# EAGLE design app1 (EAGLE 6.1)

## Sheet 1 of 8
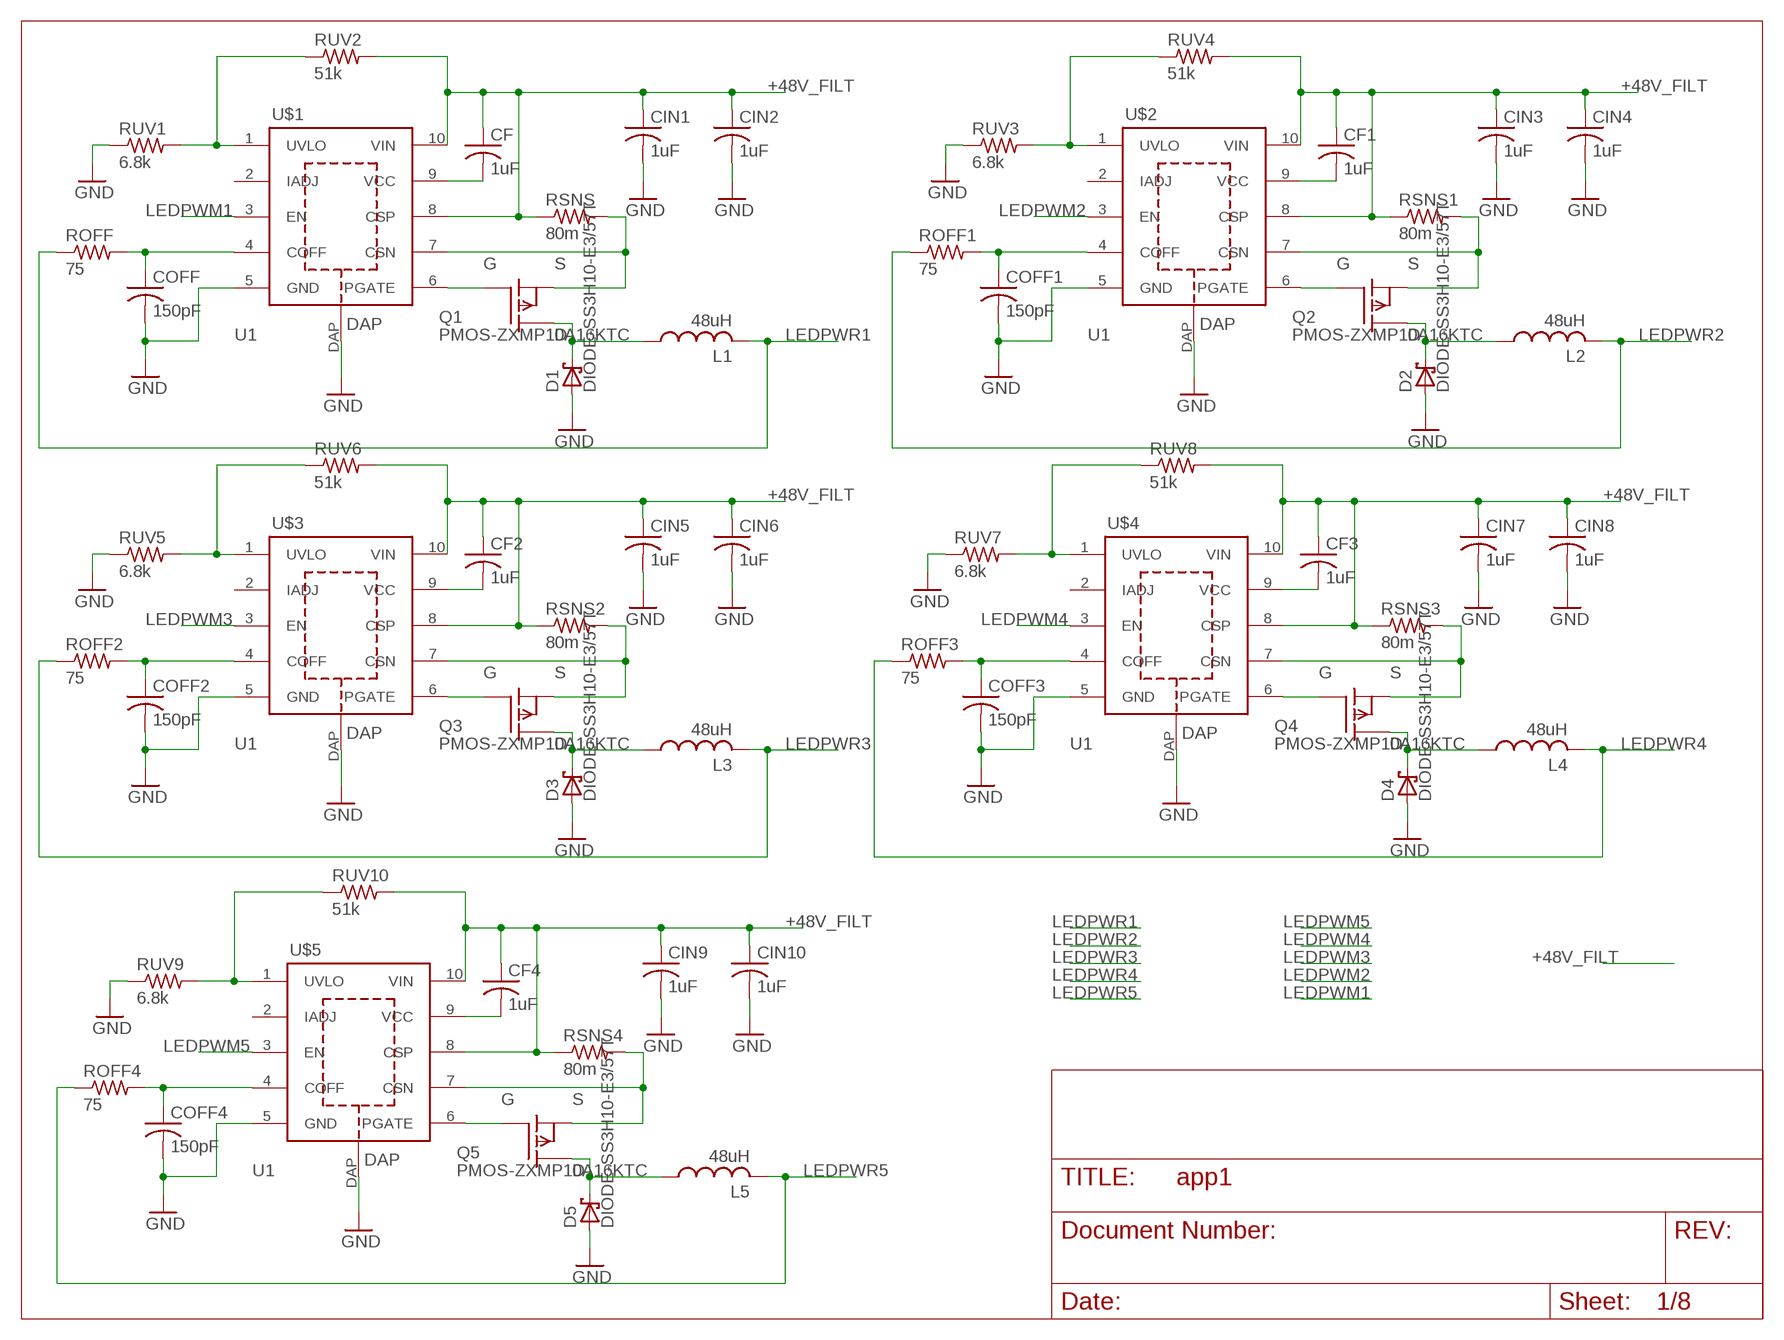
[diagram p0: schematic, sheet 1]

### Parts
CF  1uF  C-USC0603  [C0603]
CF1  1uF  C-USC0603  [C0603]
CF2  1uF  C-USC0603  [C0603]
CF3  1uF  C-USC0603  [C0603]
CF4  1uF  C-USC0603  [C0603]
CIN1  1uF  C-USC1206  [C1206]
CIN2  1uF  C-USC1206  [C1206]
CIN3  1uF  C-USC1206  [C1206]
CIN4  1uF  C-USC1206  [C1206]
CIN5  1uF  C-USC1206  [C1206]
CIN6  1uF  C-USC1206  [C1206]
CIN7  1uF  C-USC1206  [C1206]
CIN8  1uF  C-USC1206  [C1206]
CIN9  1uF  C-USC1206  [C1206]
CIN10  1uF  C-USC1206  [C1206]
COFF  150pF  C-USC0603  [C0603]
COFF1  150pF  C-USC0603  [C0603]
COFF2  150pF  C-USC0603  [C0603]
COFF3  150pF  C-USC0603  [C0603]
COFF4  150pF  C-USC0603  [C0603]
D1  DIODE-SS3H10-E3/57T  DIODE-SS3H10-E3/9AT  [SMC]
D2  DIODE-SS3H10-E3/57T  DIODE-SS3H10-E3/9AT  [SMC]
D3  DIODE-SS3H10-E3/57T  DIODE-SS3H10-E3/9AT  [SMC]
D4  DIODE-SS3H10-E3/57T  DIODE-SS3H10-E3/9AT  [SMC]
D5  DIODE-SS3H10-E3/57T  DIODE-SS3H10-E3/9AT  [SMC]
L1  48uH  SRP1265A  [SRP1265A]
L2  48uH  SRP1265A  [SRP1265A]
L3  48uH  SRP1265A  [SRP1265A]
L4  48uH  SRP1265A  [SRP1265A]
L5  48uH  SRP1265A  [SRP1265A]
Q1  PMOS-ZXMP10A16KTC  PMOS-ZXMP10A18KTC  [TO252]
Q2  PMOS-ZXMP10A16KTC  PMOS-ZXMP10A18KTC  [TO252]
Q3  PMOS-ZXMP10A16KTC  PMOS-ZXMP10A18KTC  [TO252]
Q4  PMOS-ZXMP10A16KTC  PMOS-ZXMP10A18KTC  [TO252]
Q5  PMOS-ZXMP10A16KTC  PMOS-ZXMP10A18KTC  [TO252]
ROFF  75  R-US_R0603  [R0603]
ROFF1  75  R-US_R0603  [R0603]
ROFF2  75  R-US_R0603  [R0603]
ROFF3  75  R-US_R0603  [R0603]
ROFF4  75  R-US_R0603  [R0603]
RSNS  80m  R-US_R2512  [R2512]
RSNS1  80m  R-US_R2512  [R2512]
RSNS2  80m  R-US_R2512  [R2512]
RSNS3  80m  R-US_R2512  [R2512]
RSNS4  80m  R-US_R2512  [R2512]
RUV1  6.8k  R-US_R0603  [R0603]
RUV2  51k  R-US_R0603  [R0603]
RUV3  6.8k  R-US_R0603  [R0603]
RUV4  51k  R-US_R0603  [R0603]
RUV5  6.8k  R-US_R0603  [R0603]
RUV6  51k  R-US_R0603  [R0603]
RUV7  6.8k  R-US_R0603  [R0603]
RUV8  51k  R-US_R0603  [R0603]
RUV9  6.8k  R-US_R0603  [R0603]
RUV10  51k  R-US_R0603  [R0603]
U$1  U1  LM3409HV'LM3409HV'  [VSSOP-10]
U$2  U1  LM3409HV'LM3409HV'  [VSSOP-10]
U$3  U1  LM3409HV'LM3409HV'  [VSSOP-10]
U$4  U1  LM3409HV'LM3409HV'  [VSSOP-10]
U$5  U1  LM3409HV'LM3409HV'  [VSSOP-10]

### Nets
+48V_FILT: CF1.1 CF2.1 CF3.1 CF4.1 CF.1 CIN1.1 CIN2.1 CIN3.1 CIN4.1 CIN5.1 CIN6.1 CIN7.1 CIN8.1 CIN9.1 CIN10.1 RSNS1.1 RSNS2.1 RSNS3.1 RSNS4.1 RSNS.1 RUV2.2 RUV4.2 RUV6.2 RUV8.2 RUV10.2 U$1.8(CSP) U$1.10(VIN) U$2.8(CSP) U$2.10(VIN) U$3.8(CSP) U$3.10(VIN) U$4.8(CSP) U$4.10(VIN) U$5.8(CSP) U$5.10(VIN) ; also sheet 2
GND: CIN1.2 CIN2.2 CIN3.2 CIN4.2 CIN5.2 CIN6.2 CIN7.2 CIN8.2 CIN9.2 CIN10.2 COFF1.2 COFF2.2 COFF3.2 COFF4.2 COFF.2 D1.A D2.A D3.A D4.A D5.A RUV1.1 RUV3.1 RUV5.1 RUV7.1 RUV9.1 U$1.5(GND) U$1.DAP U$2.5(GND) U$2.DAP U$3.5(GND) U$3.DAP U$4.5(GND) U$4.DAP U$5.5(GND) U$5.DAP ; also sheet 2,3,4,5,6,7,8
LEDPWM1: U$1.3(EN) ; also sheet 2
LEDPWM2: U$2.3(EN) ; also sheet 2
LEDPWM3: U$3.3(EN) ; also sheet 2
LEDPWM4: U$4.3(EN) ; also sheet 2
LEDPWM5: U$5.3(EN) ; also sheet 2
LEDPWR1: L1.P$2 ROFF.1 ; also sheet 2
LEDPWR2: L2.P$2 ROFF1.1 ; also sheet 2
LEDPWR3: L3.P$2 ROFF2.1 ; also sheet 2
LEDPWR4: L4.P$2 ROFF3.1 ; also sheet 2
LEDPWR5: L5.P$2 ROFF4.1 ; also sheet 2
N$1: RUV3.2 RUV4.1 U$2.1(UVLO)
N$2: RUV1.2 RUV2.1 U$1.1(UVLO)
N$3: CF.2 U$1.9(VCC)
N$4: Q1.2(S) RSNS.2 U$1.7(CSN)
N$5: COFF.1 ROFF.2 U$1.4(COFF)
N$6: Q1.1(G) U$1.6(PGATE)
N$7: D1.C L1.P$1 Q1.3(D)
N$8: CF1.2 U$2.9(VCC)
N$9: Q2.2(S) RSNS1.2 U$2.7(CSN)
N$10: COFF1.1 ROFF1.2 U$2.4(COFF)
N$11: Q2.1(G) U$2.6(PGATE)
N$12: D2.C L2.P$1 Q2.3(D)
N$13: RUV5.2 RUV6.1 U$3.1(UVLO)
N$14: CF2.2 U$3.9(VCC)
N$15: Q3.2(S) RSNS2.2 U$3.7(CSN)
N$16: COFF2.1 ROFF2.2 U$3.4(COFF)
N$17: Q3.1(G) U$3.6(PGATE)
N$18: D3.C L3.P$1 Q3.3(D)
N$19: RUV7.2 RUV8.1 U$4.1(UVLO)
N$20: CF3.2 U$4.9(VCC)
N$21: Q4.2(S) RSNS3.2 U$4.7(CSN)
N$22: COFF3.1 ROFF3.2 U$4.4(COFF)
N$23: Q4.1(G) U$4.6(PGATE)
N$24: D4.C L4.P$1 Q4.3(D)
N$25: RUV9.2 RUV10.1 U$5.1(UVLO)
N$26: CF4.2 U$5.9(VCC)
N$27: Q5.2(S) RSNS4.2 U$5.7(CSN)
N$28: COFF4.1 ROFF4.2 U$5.4(COFF)
N$29: Q5.1(G) U$5.6(PGATE)
N$30: D5.C L5.P$1 Q5.3(D)
Unconnected: U$1.2(IADJ) U$2.2(IADJ) U$3.2(IADJ) U$4.2(IADJ) U$5.2(IADJ)

## Sheet 2 of 8
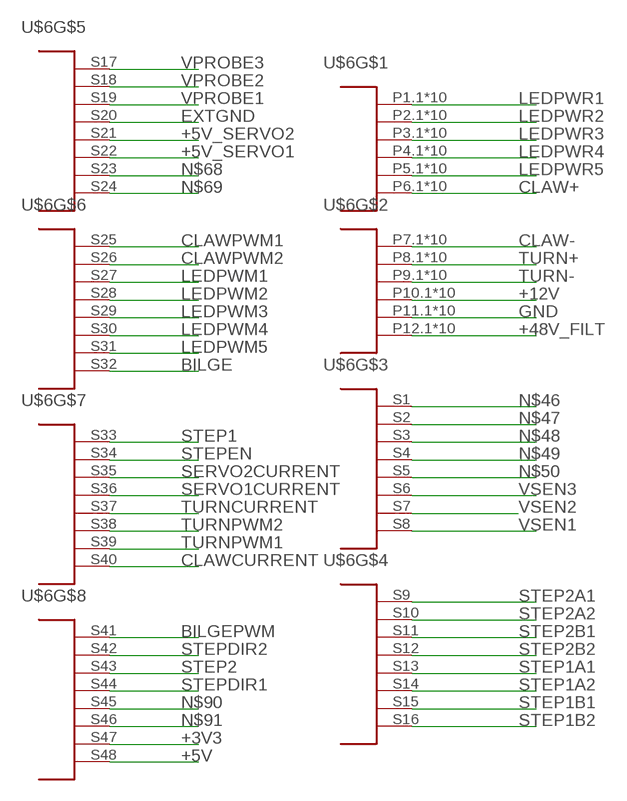
[diagram p1: schematic, sheet 2]

### Parts
U$6  TEN60-P6-S24-S24-P6-RA  [TEN60-P6-S24-S24-P6-RA]

### Nets
+3V3: U$6.S47 ; also sheet 3,5,6,7,8
+5V: U$6.S48 ; also sheet 3
+5V_SERVO1: U$6.S22 ; also sheet 3
+5V_SERVO2: U$6.S21 ; also sheet 3
+12V: U$6.P10.1 U$6.P10.2 U$6.P10.3 U$6.P10.4 U$6.P10.5 U$6.P10.6 U$6.P10.7 U$6.P10.8 U$6.P10.9 U$6.P10.10 ; also sheet 4,5,6,7
+48V_FILT: U$6.P12.1 U$6.P12.2 U$6.P12.3 U$6.P12.4 U$6.P12.5 U$6.P12.6 U$6.P12.7 U$6.P12.8 U$6.P12.9 U$6.P12.10 ; also sheet 1
BILGE: U$6.S32 ; also sheet 4
BILGEPWM: U$6.S41 ; also sheet 4
CLAW+: U$6.P6.1 U$6.P6.2 U$6.P6.3 U$6.P6.4 U$6.P6.5 U$6.P6.6 U$6.P6.7 U$6.P6.8 U$6.P6.9 U$6.P6.10 ; also sheet 5
CLAW-: U$6.P7.1 U$6.P7.2 U$6.P7.3 U$6.P7.4 U$6.P7.5 U$6.P7.6 U$6.P7.7 U$6.P7.8 U$6.P7.9 U$6.P7.10 ; also sheet 5
CLAWCURRENT: U$6.S40 ; also sheet 5
CLAWPWM1: U$6.S25 ; also sheet 5
CLAWPWM2: U$6.S26 ; also sheet 5
EXTGND: U$6.S20 ; also sheet 8
GND: U$6.P11.1 U$6.P11.2 U$6.P11.3 U$6.P11.4 U$6.P11.5 U$6.P11.6 U$6.P11.7 U$6.P11.8 U$6.P11.9 U$6.P11.10 ; also sheet 1,3,4,5,6,7,8
LEDPWM1: U$6.S27 ; also sheet 1
LEDPWM2: U$6.S28 ; also sheet 1
LEDPWM3: U$6.S29 ; also sheet 1
LEDPWM4: U$6.S30 ; also sheet 1
LEDPWM5: U$6.S31 ; also sheet 1
LEDPWR1: U$6.P1.1 U$6.P1.2 U$6.P1.3 U$6.P1.4 U$6.P1.5 U$6.P1.6 U$6.P1.7 U$6.P1.8 U$6.P1.9 U$6.P1.10 ; also sheet 1
LEDPWR2: U$6.P2.1 U$6.P2.2 U$6.P2.3 U$6.P2.4 U$6.P2.5 U$6.P2.6 U$6.P2.7 U$6.P2.8 U$6.P2.9 U$6.P2.10 ; also sheet 1
LEDPWR3: U$6.P3.1 U$6.P3.2 U$6.P3.3 U$6.P3.4 U$6.P3.5 U$6.P3.6 U$6.P3.7 U$6.P3.8 U$6.P3.9 U$6.P3.10 ; also sheet 1
LEDPWR4: U$6.P4.1 U$6.P4.2 U$6.P4.3 U$6.P4.4 U$6.P4.5 U$6.P4.6 U$6.P4.7 U$6.P4.8 U$6.P4.9 U$6.P4.10 ; also sheet 1
LEDPWR5: U$6.P5.1 U$6.P5.2 U$6.P5.3 U$6.P5.4 U$6.P5.5 U$6.P5.6 U$6.P5.7 U$6.P5.8 U$6.P5.9 U$6.P5.10 ; also sheet 1
N$46: U$6.S1
N$47: U$6.S2
N$48: U$6.S3
N$49: U$6.S4
N$50: U$6.S5
N$68: U$6.S23
N$69: U$6.S24
N$90: U$6.S45
N$91: U$6.S46
SERVO1CURRENT: U$6.S36 ; also sheet 3
SERVO2CURRENT: U$6.S35 ; also sheet 3
STEP1: U$6.S33 ; also sheet 7
STEP1A1: U$6.S13 ; also sheet 7
STEP1A2: U$6.S14 ; also sheet 7
STEP1B1: U$6.S15 ; also sheet 7
STEP1B2: U$6.S16 ; also sheet 7
STEP2: U$6.S43 ; also sheet 7
STEP2A1: U$6.S9 ; also sheet 7
STEP2A2: U$6.S10 ; also sheet 7
STEP2B1: U$6.S11 ; also sheet 7
STEP2B2: U$6.S12 ; also sheet 7
STEPDIR1: U$6.S44 ; also sheet 7
STEPDIR2: U$6.S42 ; also sheet 7
STEPEN: U$6.S34 ; also sheet 7
TURN+: U$6.P8.1 U$6.P8.2 U$6.P8.3 U$6.P8.4 U$6.P8.5 U$6.P8.6 U$6.P8.7 U$6.P8.8 U$6.P8.9 U$6.P8.10 ; also sheet 6
TURN-: U$6.P9.1 U$6.P9.2 U$6.P9.3 U$6.P9.4 U$6.P9.5 U$6.P9.6 U$6.P9.7 U$6.P9.8 U$6.P9.9 U$6.P9.10 ; also sheet 6
TURNCURRENT: U$6.S37 ; also sheet 6
TURNPWM1: U$6.S39 ; also sheet 6
TURNPWM2: U$6.S38 ; also sheet 6
VPROBE1: U$6.S19 ; also sheet 8
VPROBE2: U$6.S18 ; also sheet 8
VPROBE3: U$6.S17 ; also sheet 8
VSEN1: U$6.S8 ; also sheet 8
VSEN2: U$6.S7 ; also sheet 8
VSEN3: U$6.S6 ; also sheet 8

## Sheet 3 of 8
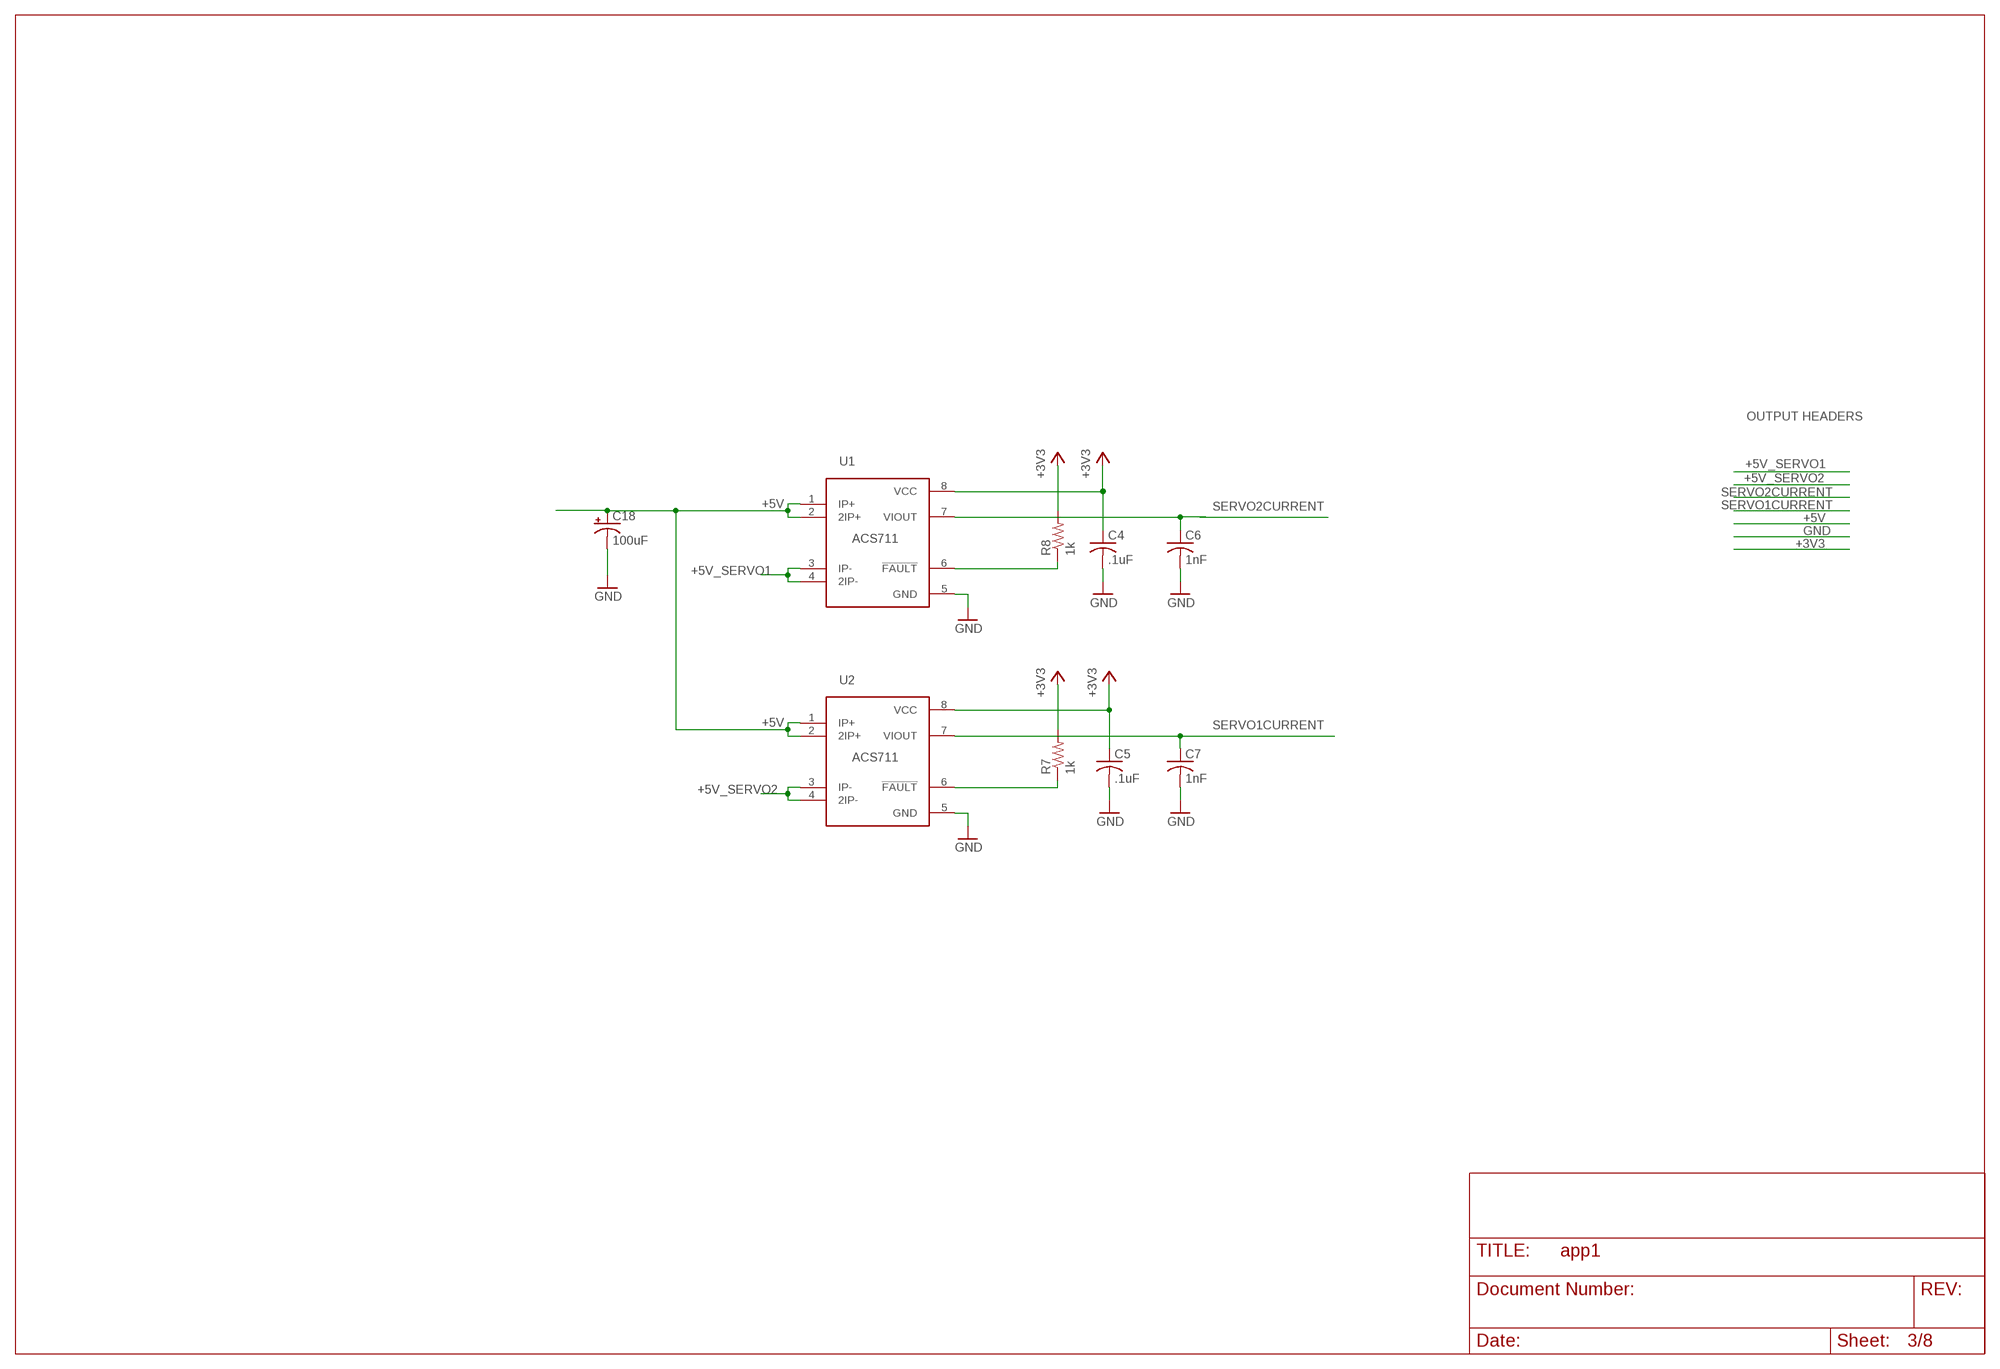
[diagram p2: schematic, sheet 3]

### Parts
C4  .1uF  C-USC0603  [C0603]
C5  .1uF  C-USC0603  [C0603]
C6  1nF  C-USC0603K  [C0603K]
C7  1nF  C-USC0603K  [C0603K]
C18  100uF  CPOL-USSANYO_SMD_B6  [SANYO-OSCON_SMD_B6]
R7  1k  R-US_R0603  [R0603]
R8  1k  R-US_R0603  [R0603]
U1  ACS711  [8SOIC]
U2  ACS711  [8SOIC]

### Nets
+3V3: C4.1 C5.1 R7.2 R8.2 U1.8(VCC) U2.8(VCC) ; also sheet 2,5,6,7,8
+5V: C18.+ U1.1(IP+) U1.2(2IP+) U2.1(IP+) U2.2(2IP+) ; also sheet 2
+5V_SERVO1: U1.3(IP-) U1.4(2IP-) ; also sheet 2
+5V_SERVO2: U2.3(IP-) U2.4(2IP-) ; also sheet 2
GND: C4.2 C5.2 C6.2 C7.2 C18.- U1.5(GND) U2.5(GND) ; also sheet 1,2,4,5,6,7,8
N$57: R7.1 U2.6(!FAULT)
N$58: R8.1 U1.6(!FAULT)
SERVO1CURRENT: C7.1 U2.7(VIOUT) ; also sheet 2
SERVO2CURRENT: C6.1 U1.7(VIOUT) ; also sheet 2

### Notes on the sheet
- OUTPUT HEADERS

## Sheet 4 of 8
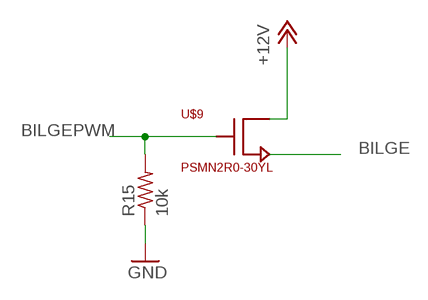
[diagram p3: schematic, sheet 4]

### Parts
R15  10k  R-US_R0603  [R0603]
U$9  PSMN2R0-30YL  [SOT669]

### Nets
+12V: U$9.MB(DRAIN) ; also sheet 2,5,6,7
BILGE: U$9.1(SOURCE) U$9.2(SOURCE) U$9.3(SOURCE) ; also sheet 2
BILGEPWM: R15.2 U$9.4(GATE) ; also sheet 2
GND: R15.1 ; also sheet 1,2,3,5,6,7,8

## Sheet 5 of 8
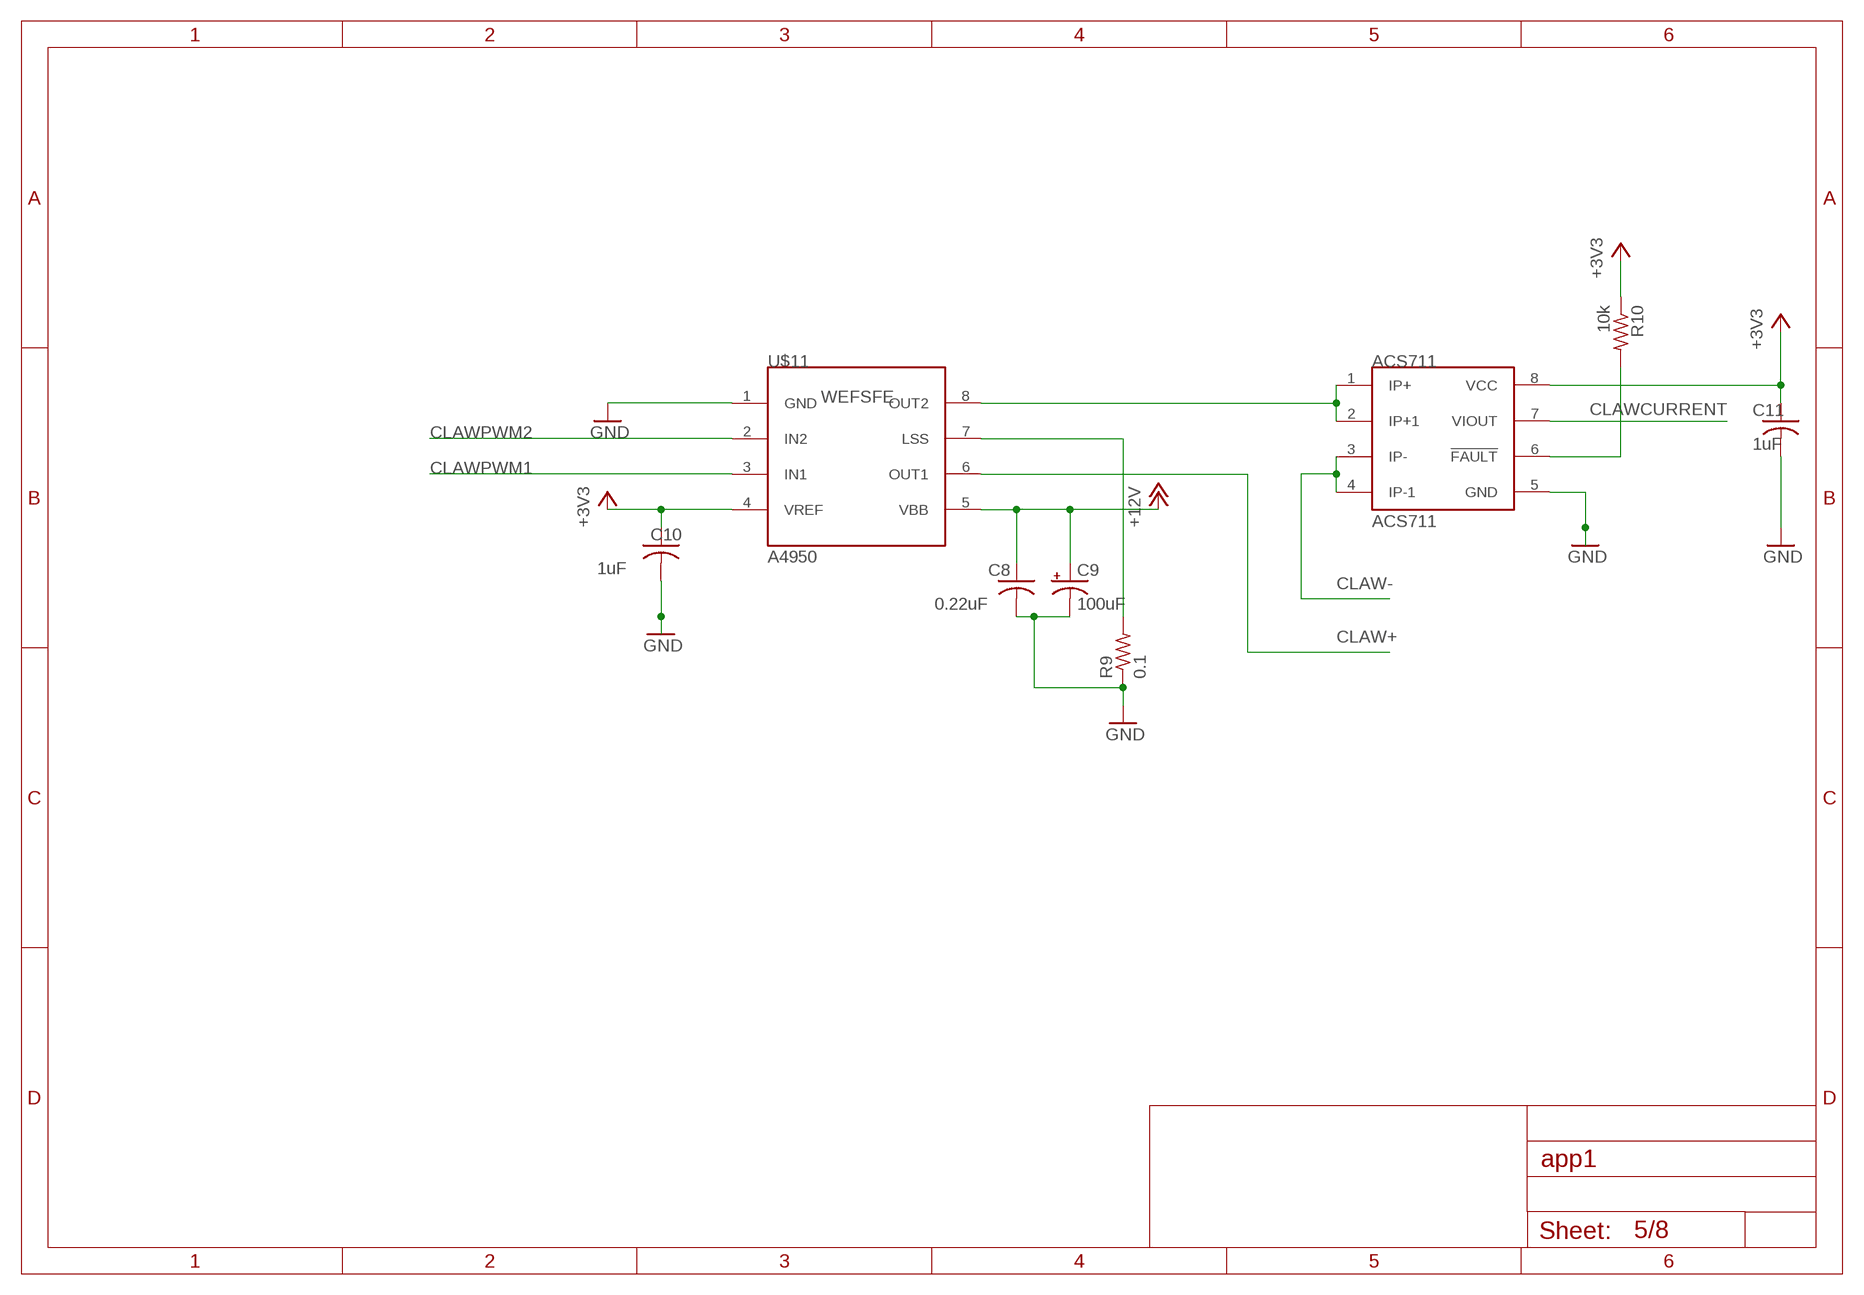
[diagram p4: schematic, sheet 5]

### Parts
ACS711  ACS711  [SOIC8]
C8  0.22uF  C-USC0603  [C0603]
C9  100uF  CPOL-USSANYO_SMD_B6  [SANYO-OSCON_SMD_B6]
C10  1uF  C-USC0603  [C0603]
C11  1uF  C-USC0603  [C0603]
R9  0.1  R-US_R0603  [R0603]
R10  10k  R-US_R0603  [R0603]
U$11  A4950  [SOIC8-PAD]

### Nets
+3V3: ACS711.8(VCC) C10.1 C11.1 R10.1 U$11.4(VREF) ; also sheet 2,3,6,7,8
+12V: C8.1 C9.+ U$11.5(VBB) ; also sheet 2,4,6,7
CLAW+: U$11.6(OUT1) ; also sheet 2
CLAW-: ACS711.3(IP-) ACS711.4(IP-1) ; also sheet 2
CLAWCURRENT: ACS711.7(VIOUT) ; also sheet 2
CLAWPWM1: U$11.3(IN1) ; also sheet 2
CLAWPWM2: U$11.2(IN2) ; also sheet 2
GND: ACS711.5(GND) C8.2 C9.- C10.2 C11.2 R9.1 U$11.1(GND) ; also sheet 1,2,3,4,6,7,8
N$34: R9.2 U$11.7(LSS)
N$35: ACS711.6(!FAULT) R10.2
WEFSFE: ACS711.1(IP+) ACS711.2(IP+1) U$11.8(OUT2)

## Sheet 6 of 8
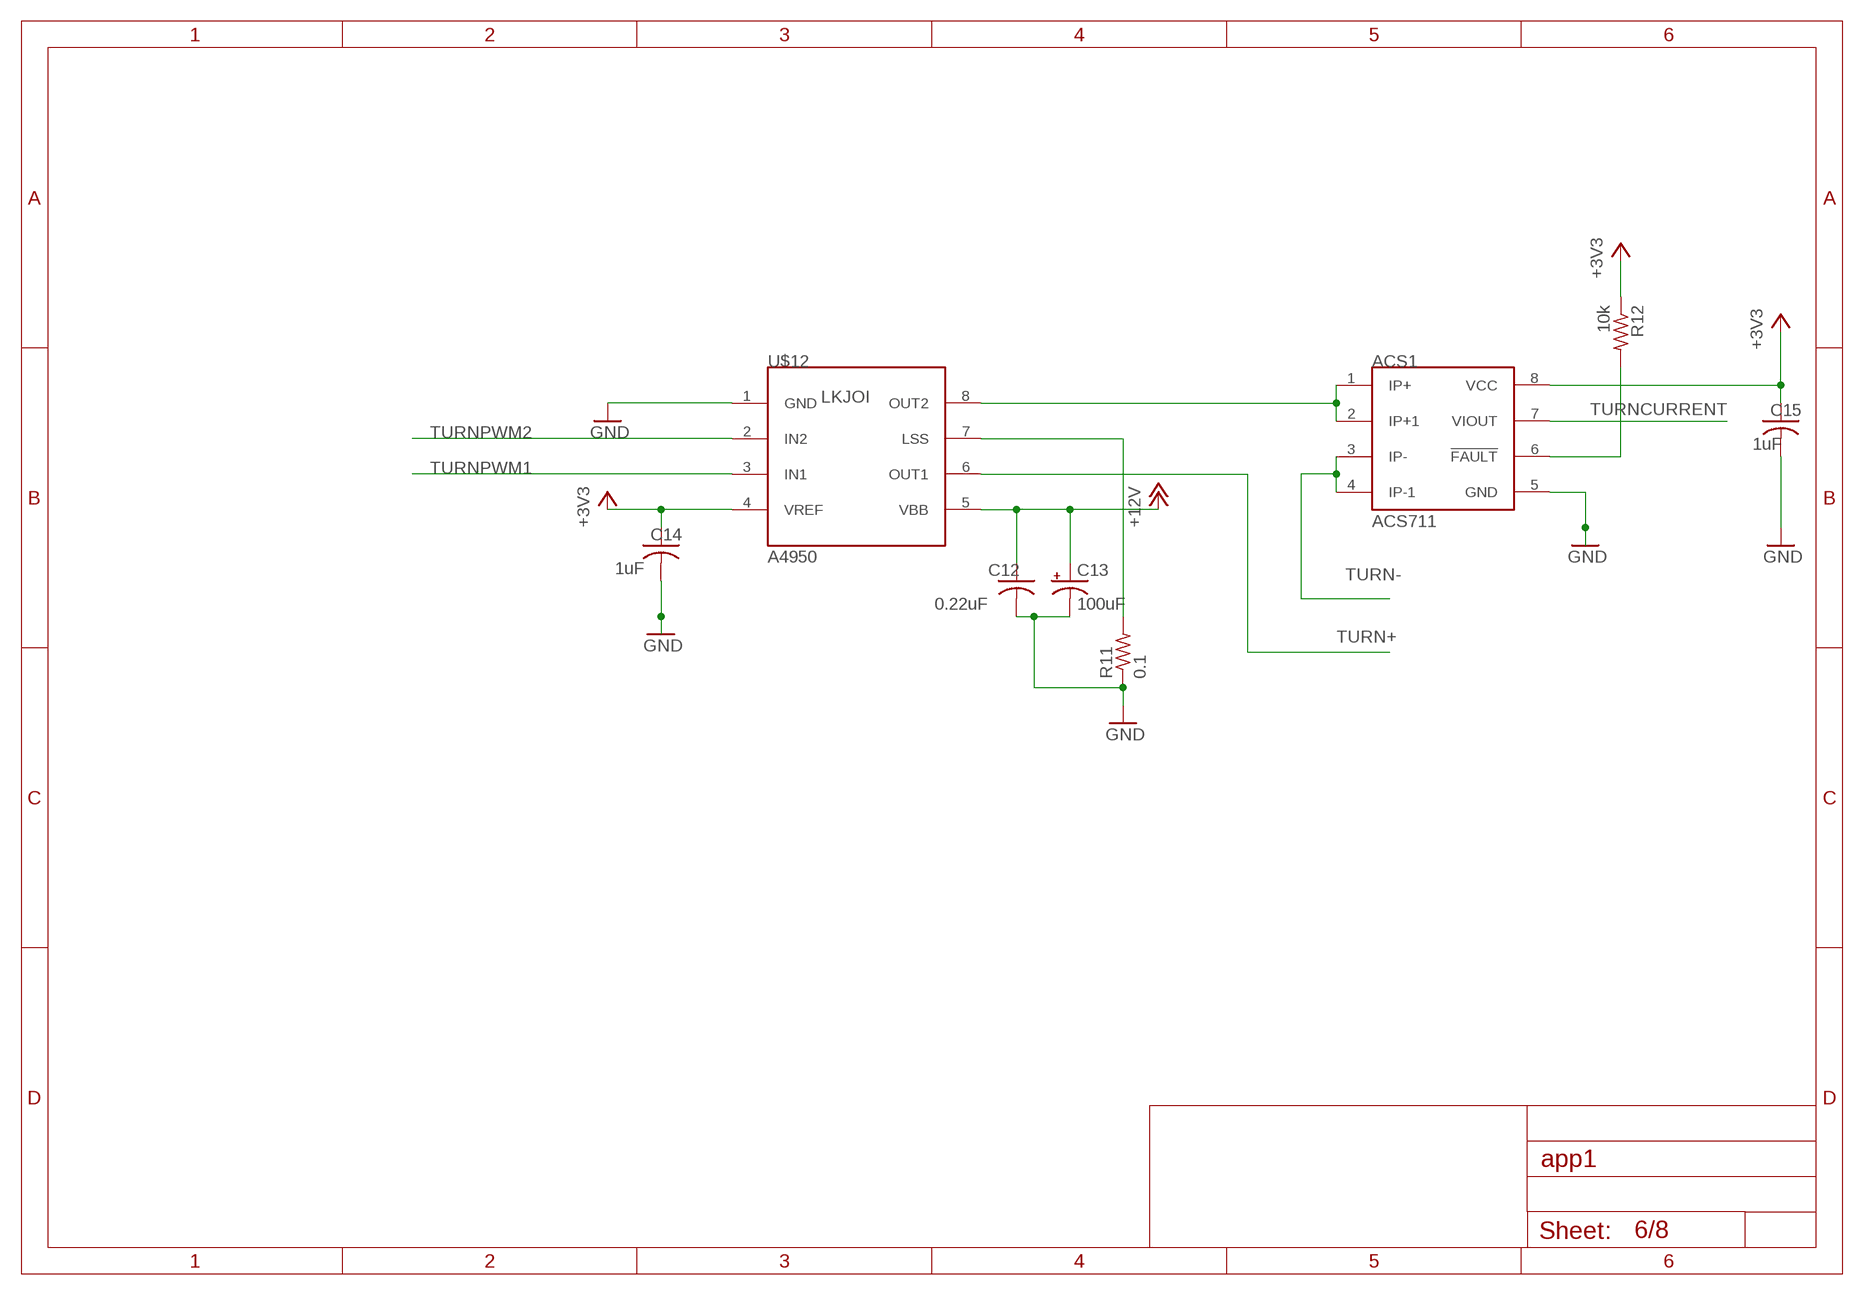
[diagram p5: schematic, sheet 6]

### Parts
ACS1  ACS711  [SOIC8]
C12  0.22uF  C-USC0603  [C0603]
C13  100uF  CPOL-USSANYO_SMD_B6  [SANYO-OSCON_SMD_B6]
C14  1uF  C-USC0603  [C0603]
C15  1uF  C-USC0603  [C0603]
R11  0.1  R-US_R0603  [R0603]
R12  10k  R-US_R0603  [R0603]
U$12  A4950  [SOIC8-PAD]

### Nets
+3V3: ACS1.8(VCC) C14.1 C15.1 R12.1 U$12.4(VREF) ; also sheet 2,3,5,7,8
+12V: C12.1 C13.+ U$12.5(VBB) ; also sheet 2,4,5,7
GND: ACS1.5(GND) C12.2 C13.- C14.2 C15.2 R11.1 U$12.1(GND) ; also sheet 1,2,3,4,5,7,8
LKJOI: ACS1.1(IP+) ACS1.2(IP+1) U$12.8(OUT2)
N$41: R11.2 U$12.7(LSS)
N$42: ACS1.6(!FAULT) R12.2
TURN+: U$12.6(OUT1) ; also sheet 2
TURN-: ACS1.3(IP-) ACS1.4(IP-1) ; also sheet 2
TURNCURRENT: ACS1.7(VIOUT) ; also sheet 2
TURNPWM1: U$12.3(IN1) ; also sheet 2
TURNPWM2: U$12.2(IN2) ; also sheet 2

## Sheet 7 of 8
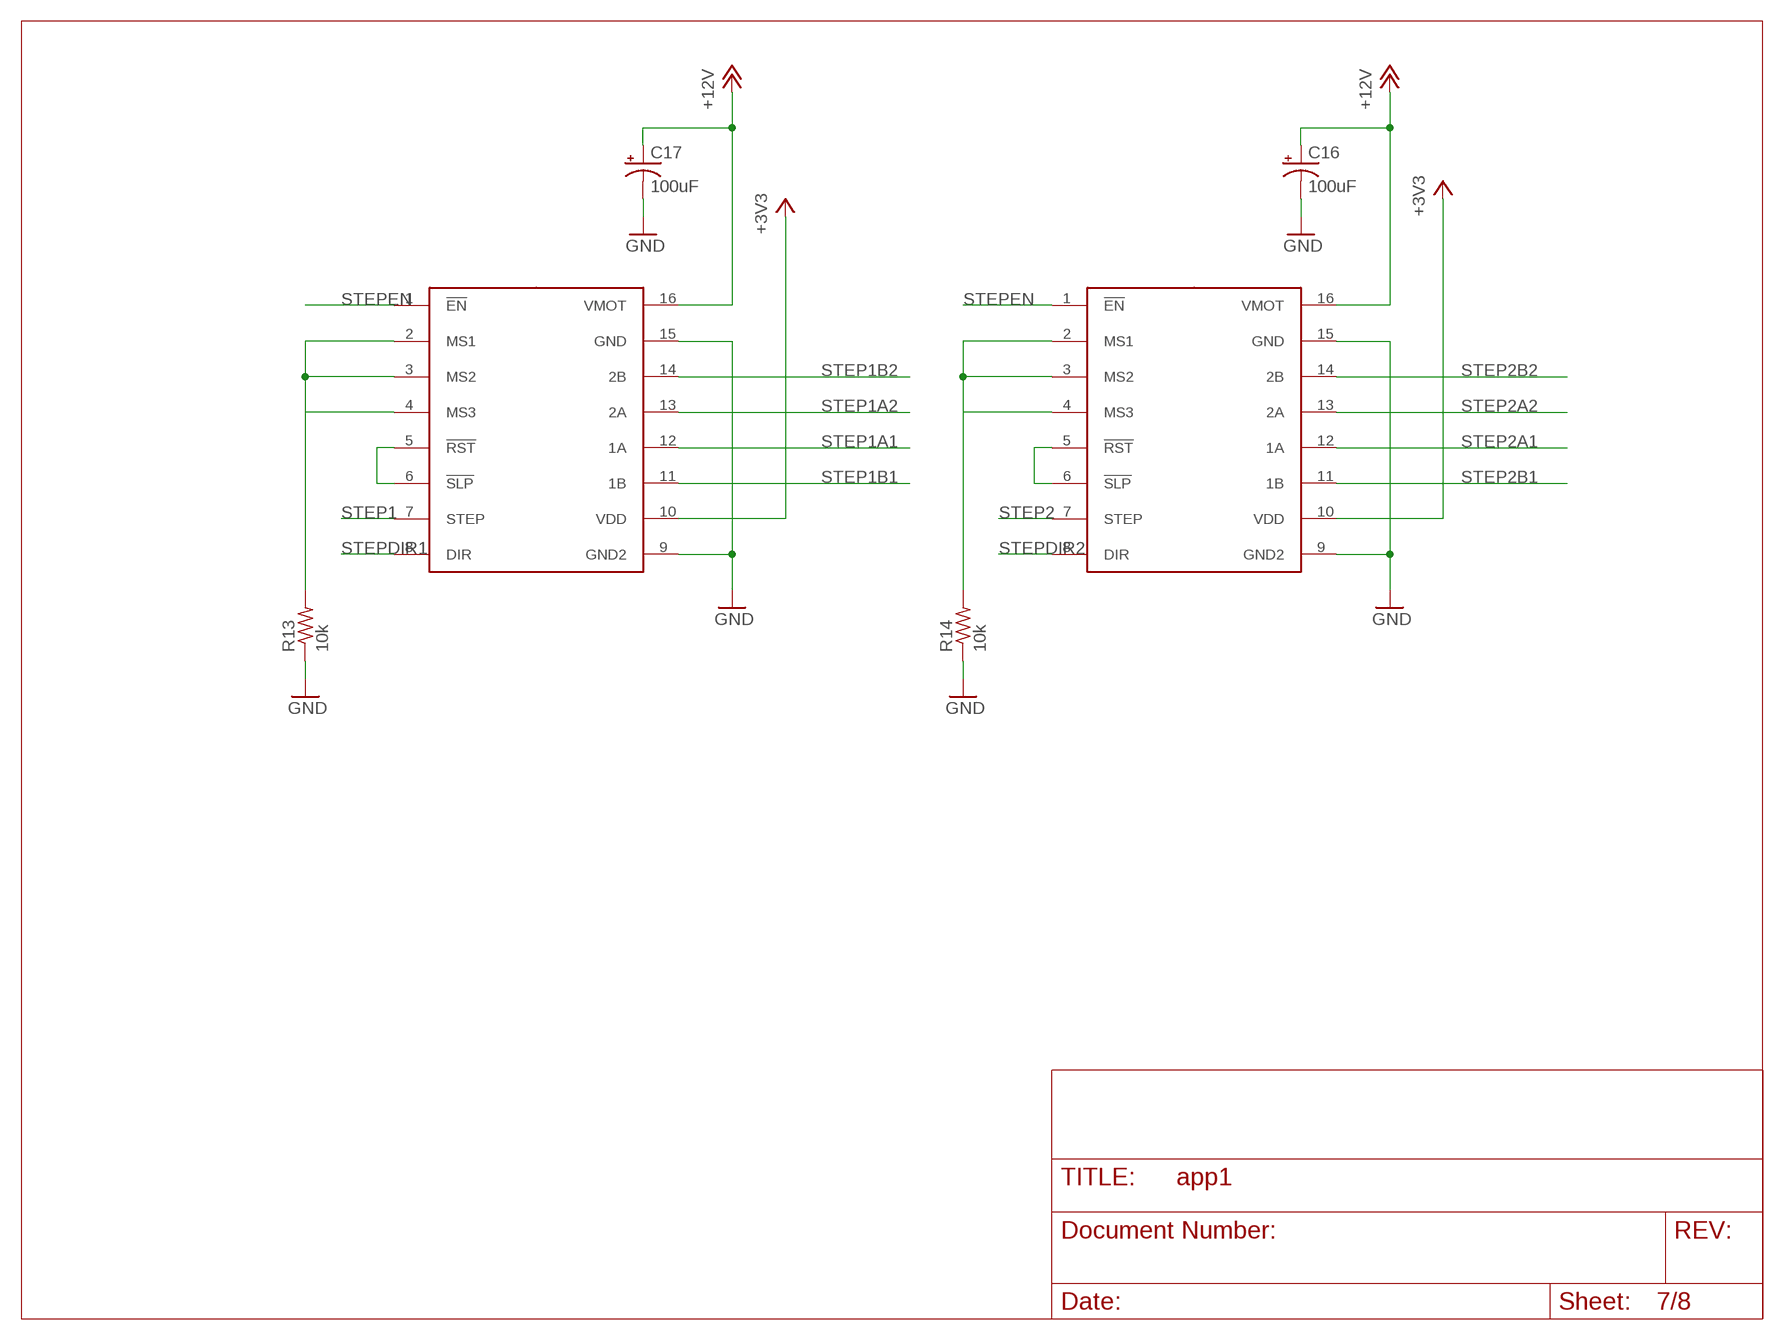
[diagram p6: schematic, sheet 7]

### Parts
C16  100uF  CPOL-USSANYO_SMD_B6  [SANYO-OSCON_SMD_B6]
C17  100uF  CPOL-USSANYO_SMD_B6  [SANYO-OSCON_SMD_B6]
R13  10k  R-US_R0603  [R0603]
R14  10k  R-US_R0603  [R0603]
U$7  A4988  [FE08-2-0.6]
U$8  A4988  [FE08-2-0.6]

### Nets
+3V3: U$7.10(VDD) U$8.10(VDD) ; also sheet 2,3,5,6,8
+12V: C16.+ C17.+ U$7.16(VMOT) U$8.16(VMOT) ; also sheet 2,4,5,6
GND: C16.- C17.- R13.1 R14.1 U$7.9(GND2) U$7.15(GND) U$8.9(GND2) U$8.15(GND) ; also sheet 1,2,3,4,5,6,8
N$53: R13.2 U$7.2(MS1) U$7.3(MS2) U$7.4(MS3)
N$54: U$7.5(!RST) U$7.6(!SLP)
N$55: R14.2 U$8.2(MS1) U$8.3(MS2) U$8.4(MS3)
N$56: U$8.5(!RST) U$8.6(!SLP)
STEP1: U$7.7(STEP) ; also sheet 2
STEP1A1: U$7.12(1A) ; also sheet 2
STEP1A2: U$7.13(2A) ; also sheet 2
STEP1B1: U$7.11(1B) ; also sheet 2
STEP1B2: U$7.14(2B) ; also sheet 2
STEP2: U$8.7(STEP) ; also sheet 2
STEP2A1: U$8.12(1A) ; also sheet 2
STEP2A2: U$8.13(2A) ; also sheet 2
STEP2B1: U$8.11(1B) ; also sheet 2
STEP2B2: U$8.14(2B) ; also sheet 2
STEPDIR1: U$7.8(DIR) ; also sheet 2
STEPDIR2: U$8.8(DIR) ; also sheet 2
STEPEN: U$7.1(!EN) U$8.1(!EN) ; also sheet 2

## Sheet 8 of 8
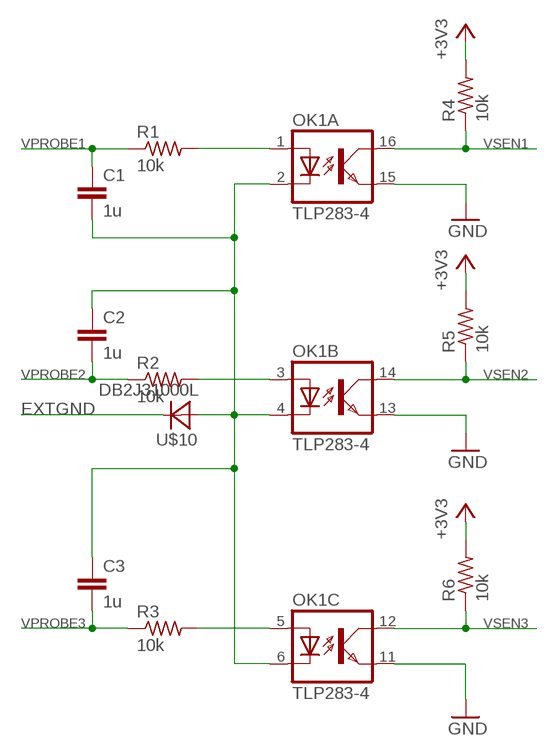
[diagram p7: schematic, sheet 8]

### Parts
C1  1u  C-EUC0603  [C0603]
C2  1u  C-EUC0603  [C0603]
C3  1u  C-EUC0603  [C0603]
OK1  TLP283-4  [MINI-FLAT-16]
R1  10k  R-US_R0603  [R0603]
R2  10k  R-US_R0603  [R0603]
R3  10k  R-US_R0603  [R0603]
R4  10k  R-US_R0603  [R0603]
R5  10k  R-US_R0603  [R0603]
R6  10k  R-US_R0603  [R0603]
U$10  DB2J31000L  [SOD323-R]

### Nets
23989SDFJA: C1.2 C2.1 C3.1 OK1.2(A:C) OK1.4(B:C) OK1.6(C:C) U$10.A
+3V3: R4.2 R5.2 R6.2 ; also sheet 2,3,5,6,7
EXTGND: U$10.C ; also sheet 2
GND: OK1.11(C:EMIT) OK1.13(B:EMIT) OK1.15(A:EMIT) ; also sheet 1,2,3,4,5,6,7
N$31: OK1.1(A:A) R1.2
N$32: OK1.3(B:A) R2.2
N$33: OK1.5(C:A) R3.2
VPROBE1: C1.1 R1.1 ; also sheet 2
VPROBE2: C2.2 R2.1 ; also sheet 2
VPROBE3: C3.2 R3.1 ; also sheet 2
VSEN1: OK1.16(A:COL) R4.1 ; also sheet 2
VSEN2: OK1.14(B:COL) R5.1 ; also sheet 2
VSEN3: OK1.12(C:COL) R6.1 ; also sheet 2
Unconnected: OK1.7(D:A) OK1.8(D:C) OK1.9(D:EMIT) OK1.10(D:COL)

## Library data of the parts
ACS1 ACS711 = ACS711:ACS711: ACS711 Current sensor www.allegromicro.com/~/Media/Files/Datasheets/ACS711-Datasheet.ashx
C1-C3 = rcl:C-EU: CAPACITOR, European symbol
C4-C7 = resistor:C-US: CAPACITOR, American symbol
C8 C10-C12 C14 C15 CF CF1-CF4 CIN1-CIN10 COFF COFF1-COFF4 = rcl:C-US: CAPACITOR, American symbol
C9 C13 C16-C18 = rcl:CPOL-US: POLARIZED CAPACITOR, American symbol
D1-D5 = Rodolfos Awesome Custom Parts Library:DIODE-SS3H10-E3/9AT
L1-L5 = Rodolfos Awesome Custom Parts Library:SRP1265A
OK1 = optocoupler:TLP283-4: TOSHIBA PHOTOCOUPLER GaAs IRED & PHOTO-TRANSISTOR Source: http://www.semicon.toshiba.co.jp/td/en/Opto/Photocoupler/en_20050928_TLP283_datasheet.pdf; OC_FARNELL: unknown; OC_NEWARK: unknown
Q1-Q5 = Rodolfos Awesome Custom Parts Library:PMOS-ZXMP10A18KTC
R1-R6 R9-R12 R15 ROFF ROFF1-ROFF4 RSNS RSNS1-RSNS4 RUV1-RUV10 = rcl:R-US_: RESISTOR, American symbol
R7 R8 R13 R14 = resistor:R-US_: RESISTOR, American symbol
U1 U2 = 8SOIC:ACS711
U$1-U$5 = Rodolfos Awesome Custom Parts Library:LM3409HV
U$6 = BackplaneConnector:TEN60-P6-S24-S24-P6-RA
U$7 U$8 = stepper-driver:A4988
U$9 = evan:PSMN2R0-30YL
U$10 = evan:DB2J31000L
U$11 U$12 = A4950:A4950: A4950 Motor Driver www.allegromicro.com/~/Media/Files/Datasheets/A4950-Datasheet.ashx

## Board
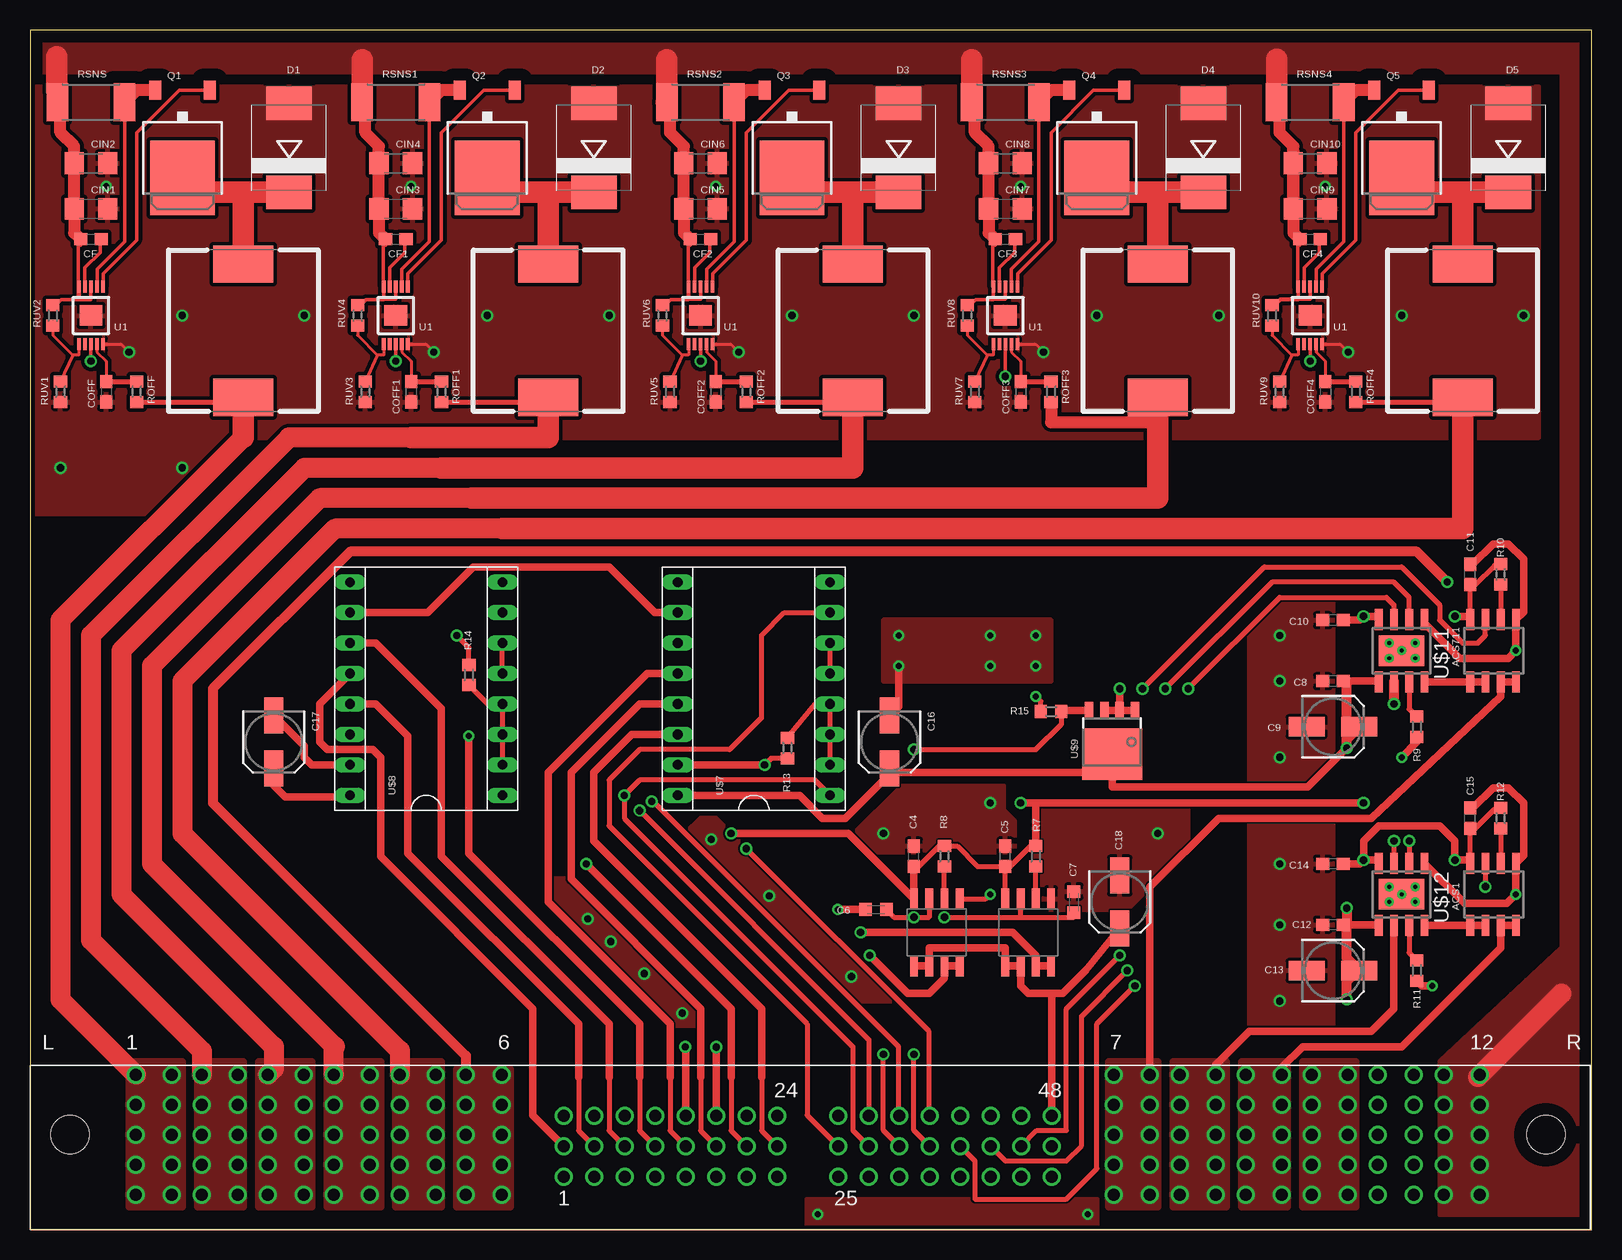
[diagram p8: board, top side]
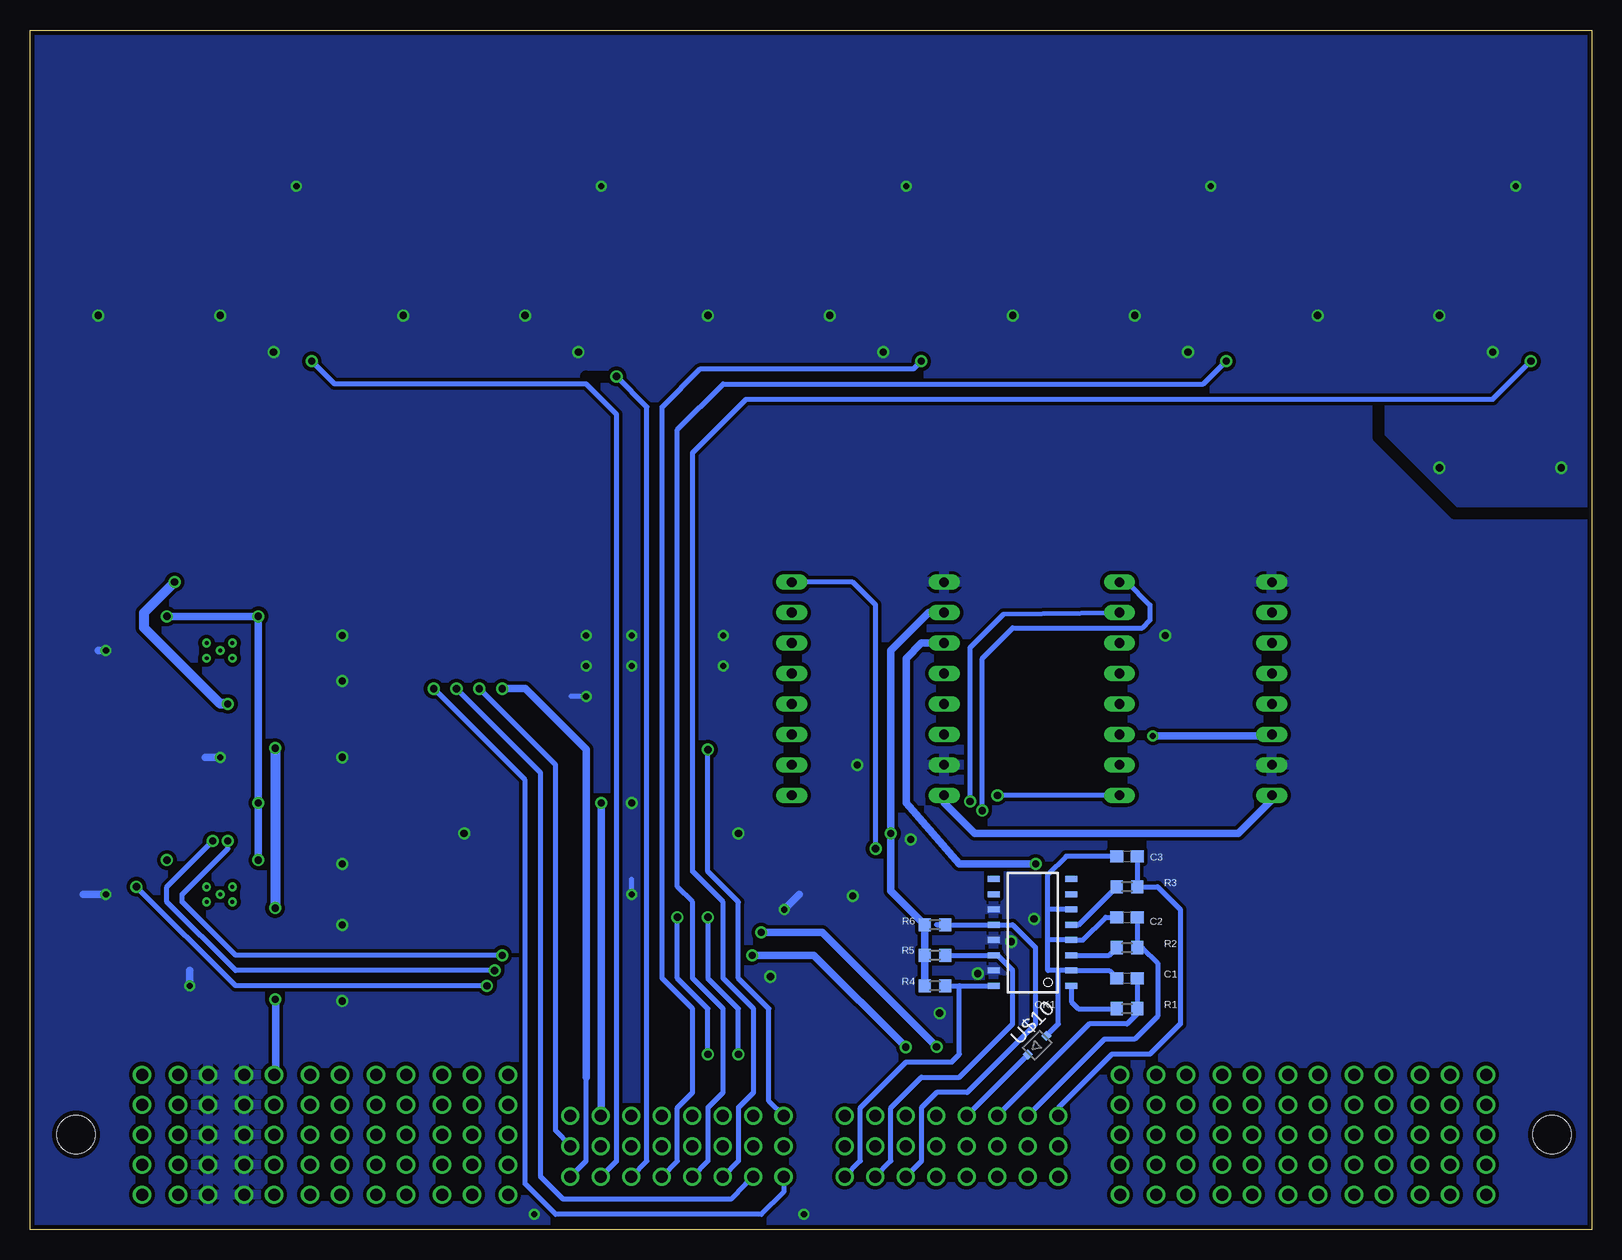
[diagram p9: board, bottom side, seen from below]

Size 130.16 x 100 mm. Coordinates in mm from the lower left corner, seen from the top.
Outline: 0,0 130.16,0 130.16,100 0,100 0,0
Copper layers (1*16): Top 0.035559375mm / dielectric 1.501140625mm / Bottom 0.035559375mm
Design rules: minimum track width 10mil, minimum drill 15mil, track to track 6mil, track to pad 6mil, pad to pad 6mil, via to via 6mil, smd to smd 6mil, copper to edge 15mil, drill to drill 8mil, minimum pad ring 10mil, minimum via ring 8mil, stop-mask expansion 4mil, vias tented up to drill 0mil, thermal gap 10mil
bRestrict: area -60.6,192.8 to -58.4,196.8; area -42.9,192.8 to -40.6,196.8; area -25,203.6 to -21.6,206.2; area -61.8,153.4 to -59.7,157.5; area -44.2,153.4 to -41.9,157.5; area -26.3,164.2 to -22.9,166.9; 4 lines

### Footprints (pad centres in the part's own frame; a part is rotated, then mirrored left to right if it is on the bottom)
SOIC8 = smd 0.65 x 1.75: 1 -1.905,-2.6; 2 -0.635,-2.6; 3 0.635,-2.6; 4 1.905,-2.6; 5 1.905,2.6; 6 0.635,2.6; 7 -0.635,2.6; 8 -1.905,2.6
C0603 = smd 1.1 x 1: 1 -0.85,0; 2 0.85,0
C0603K = smd 1.05 x 1.08: 1 -0.875,0; 2 0.875,0
SANYO-OSCON_SMD_B6 = smd 3 x 1.6: + 2.2,0; - -2.2,0
C1206 = smd 1.6 x 1.8: 1 -1.4,0; 2 1.4,0
SMC = smd 2.8 x 3.8: A 3.7,0; C -3.7,0
SRP1265A = smd 3.099 x 5.004: P$1 -5.55,0; P$2 5.55,0
MINI-FLAT-16 = smd 1 x 0.5: 1 -3.24,4.445; 2 -3.24,3.175; 3 -3.24,1.905; 4 -3.24,0.635; 5 -3.24,-0.635; 6 -3.24,-1.905; 7 -3.24,-3.175; 8 -3.24,-4.445; 9 3.24,-4.445; 10 3.24,-3.175; 11 3.24,-1.905; 12 3.24,-0.635; 13 3.24,0.635; 14 3.24,1.905; 15 3.24,3.175; 16 3.24,4.445
TO252 = smd 1 x 1.6: 1 -2.28,-4.8; 2 2.28,-4.8 | smd 5.4 x 6.2: 3 0,2.5
R0603 = smd 1 x 1.1: 1 -0.85,0; 2 0.85,0
R2512 = smd 1.8 x 3.2: 1 -2.8,0; 2 2.8,0
8SOIC = smd 1.75 x 0.65: 1 -2.8,1.905; 2 -2.8,0.635; 3 -2.8,-0.635; 4 -2.8,-1.905; 5 2.8,-1.905; 6 2.8,-0.635; 7 2.8,0.635; 8 2.8,1.905
VSSOP-10 = smd 0.305 x 1.016: 1 -1.001,-2.4; 2 -0.5,-2.4; 3 0,-2.4; 4 0.5,-2.4; 5 1.001,-2.4; 6 1.001,2.4; 7 0.5,2.4; 8 0,2.4; 9 -0.5,2.4; 10 -1.001,2.4 | smd 1.905 x 1.727: DAP 0,0
TEN60-P6-S24-S24-P6-RA = drill 1: P1.1 8.82,12.9; P1.2 8.82,10.4; P1.3 8.82,7.9; P1.4 8.82,5.4; P1.5 8.82,2.9; P1.6 11.82,2.9; P1.7 11.82,5.4; P1.8 11.82,7.9; P1.9 11.82,10.4; P1.10 11.82,12.9; P2.1 14.32,12.9; P2.2 14.32,10.4; P2.3 14.32,7.9; P2.4 14.32,5.4; P2.5 14.32,2.9; P2.6 17.32,2.9; P2.7 17.32,5.4; P2.8 17.32,7.9; P2.9 17.32,10.4; P2.10 17.32,12.9; P3.1 19.82,12.9; P3.2 19.82,10.4; P3.3 19.82,7.9; P3.4 19.82,5.4; P3.5 19.82,2.9; P3.6 22.82,2.9; P3.7 22.82,5.4; P3.8 22.82,7.9; P3.9 22.82,10.4; P3.10 22.82,12.9; P4.1 25.32,12.9; P4.2 25.32,10.4; P4.3 25.32,7.9; P4.4 25.32,5.4; P4.5 25.32,2.9; P4.6 28.32,2.9; P4.7 28.32,5.4; P4.8 28.32,7.9; P4.9 28.32,10.4; P4.10 28.32,12.9; P5.1 30.82,12.9; P5.2 30.82,10.4; P5.3 30.82,7.9; P5.4 30.82,5.4; P5.5 30.82,2.9; P5.6 33.82,2.9; P5.7 33.82,5.4; P5.8 33.82,7.9; P5.9 33.82,10.4; P5.10 33.82,12.9; P6.1 36.32,12.9; P6.2 36.32,10.4; P6.3 36.32,7.9; P6.4 36.32,5.4; P6.5 36.32,2.9; P6.6 39.32,2.9; P6.7 39.32,5.4; P6.8 39.32,7.9; P6.9 39.32,10.4; P6.10 39.32,12.9; P7.1 90.32,12.9; P7.2 90.32,10.4; P7.3 90.32,7.9; P7.4 90.32,5.4; P7.5 90.32,2.9; P7.6 93.32,2.9; P7.7 93.32,5.4; P7.8 93.32,7.9; P7.9 93.32,10.4; P7.10 93.32,12.9; P8.1 95.82,12.9; P8.2 95.82,10.4; P8.3 95.82,7.9; P8.4 95.82,5.4; P8.5 95.82,2.9; P8.6 98.82,2.9; P8.7 98.82,5.4; P8.8 98.82,7.9; P8.9 98.82,10.4; P8.10 98.82,12.9; P9.1 101.32,12.9; P9.2 101.32,10.4; P9.3 101.32,7.9; P9.4 101.32,5.4; P9.5 101.32,2.9; P9.6 104.32,2.9; P9.7 104.32,5.4; P9.8 104.32,7.9; P9.9 104.32,10.4; P9.10 104.32,12.9; P10.1 106.82,12.9; P10.2 106.82,10.4; P10.3 106.82,7.9; P10.4 106.82,5.4; P10.5 106.82,2.9; P10.6 109.82,2.9; P10.7 109.82,5.4; P10.8 109.82,7.9; P10.9 109.82,10.4; P10.10 109.82,12.9; P11.1 112.32,12.9; P11.2 112.32,10.4; P11.3 112.32,7.9; P11.4 112.32,5.4; P11.5 112.32,2.9; P11.6 115.32,2.9; P11.7 115.32,5.4; P11.8 115.32,7.9; P11.9 115.32,10.4; P11.10 115.32,12.9; P12.1 117.82,12.9; P12.2 117.82,10.4; P12.3 117.82,7.9; P12.4 117.82,5.4; P12.5 117.82,2.9; P12.6 120.82,2.9; P12.7 120.82,5.4; P12.8 120.82,7.9; P12.9 120.82,10.4; P12.10 120.82,12.9; S1 44.48,4.4; S2 47.02,4.4; S3 49.56,4.4; S4 52.1,4.4; S5 54.64,4.4; S6 57.18,4.4; S7 59.72,4.4; S8 62.26,4.4; S9 44.48,6.94; S10 47.02,6.94; S11 49.56,6.94; S12 52.1,6.94; S13 54.64,6.94; S14 57.18,6.94; S15 59.72,6.94; S16 62.26,6.94; S17 44.48,9.48; S18 47.02,9.48; S19 49.56,9.48; S20 52.1,9.48; S21 54.64,9.48; S22 57.18,9.48; S23 59.72,9.48; S24 62.26,9.48; S25 67.36,4.4; S26 69.9,4.4; S27 72.44,4.4; S28 74.98,4.4; S29 77.52,4.4; S30 80.06,4.4; S31 82.6,4.4; S32 85.14,4.4; S33 67.36,6.94; S34 69.9,6.94; S35 72.44,6.94; S36 74.98,6.94; S37 77.52,6.94; S38 80.06,6.94; S39 82.6,6.94; S40 85.14,6.94; S41 67.36,9.48; S42 69.9,9.48; S43 72.44,9.48; S44 74.98,9.48; S45 77.52,9.48; S46 80.06,9.48; S47 82.6,9.48; S48 85.14,9.48 | hole 3.2: 3.32,7.9; 126.32,7.9
FE08-2-0.6 = drill 0.8 long: 1 -8.89,-6.35; 2 -6.35,-6.35; 3 -3.81,-6.35; 4 -1.27,-6.35; 5 1.27,-6.35; 6 3.81,-6.35; 7 6.35,-6.35; 8 8.89,-6.35; 9 8.89,6.35; 10 6.35,6.35; 11 3.81,6.35; 12 1.27,6.35; 13 -1.27,6.35; 14 -3.81,6.35; 15 -6.35,6.35; 16 -8.89,6.35
SOT669 = smd 0.7 x 1.4: 1 -1.905,-2.65; 2 -0.635,-2.65; 3 0.635,-2.65; 4 1.905,-2.65 | smd 5 x 4.3: MB 0,1
SOD323-R = smd 0.6 x 0.6: A 1.1,0; C -1.1,0
SOIC8-PAD = smd 0.65 x 1.75: 1 -1.905,-2.6; 2 -0.635,-2.6; 3 0.635,-2.6; 4 1.905,-2.6; 5 1.905,2.6; 6 0.635,2.6; 7 -0.635,2.6; 8 -1.905,2.6 | smd 3.81 x 2.54: P$1 0,0

### Placement (x,y rotation side)
ACS1  121.92,27.94 0 top
ACS711  121.92,48.26 0 top
C1  38.73,20.95 180 bottom
C2  38.73,26.04 0 bottom
C3  38.73,31.11 0 bottom
C4  73.66,31.11 90 top
C5  81.28,31.11 90 top
C6  70.48,26.67 180 top
C7  87,27.3 90 top
C8  108.58,45.72 180 top
C9  108.58,41.91 0 top
C10  108.58,50.8 180 top
C11  120.02,54.61 90 top
C12  108.58,25.4 180 top
C13  108.58,21.59 0 top
C14  108.58,30.48 180 top
C15  120.02,34.29 90 top
C16  71.63,40.64 270 top
C17  20.32,40.64 270 top
C18  90.81,27.3 270 top
CF  5.08,82.55 0 top
CF1  30.48,82.55 0 top
CF2  55.88,82.55 0 top
CF3  81.28,82.55 0 top
CF4  106.68,82.55 0 top
CIN1  5.08,85.09 0 top
CIN2  5.08,88.9 0 top
CIN3  30.48,85.09 0 top
CIN4  30.48,88.9 0 top
CIN5  55.88,85.09 0 top
CIN6  55.88,88.9 0 top
CIN7  81.28,85.09 0 top
CIN8  81.28,88.9 0 top
CIN9  106.68,85.09 0 top
CIN10  106.68,88.9 0 top
COFF  6.35,69.85 270 top
COFF1  31.75,69.85 270 top
COFF2  57.15,69.85 270 top
COFF3  82.55,69.85 270 top
COFF4  107.95,69.85 270 top
D1  21.59,90.17 90 top
D2  46.99,90.17 90 top
D3  72.39,90.17 90 top
D4  97.79,90.17 90 top
D5  123.19,90.17 90 top
L1  17.78,74.93 270 top
L2  43.18,74.93 270 top
L3  68.58,74.93 270 top
L4  93.98,74.93 270 top
L5  119.38,74.93 270 top
OK1  46.61,24.77 180 bottom
Q1  12.7,90.17 180 top
Q2  38.1,90.17 180 top
Q3  63.5,90.17 180 top
Q4  88.9,90.17 180 top
Q5  114.3,90.17 180 top
R1  38.73,18.41 180 bottom
R2  38.73,23.5 180 bottom
R3  38.73,28.57 180 bottom
R4  54.74,20.32 180 bottom
R5  54.74,22.86 180 bottom
R6  54.74,25.4 180 bottom
R7  83.82,31.11 90 top
R8  76.2,31.11 90 top
R9  115.57,41.91 90 top
R10  122.56,54.61 270 top
R11  115.57,21.59 90 top
R12  122.56,34.29 270 top
R13  63.12,40.13 90 top
R14  36.58,46.23 270 top
R15  85.09,43.18 0 top
ROFF  8.89,69.85 90 top
ROFF1  34.29,69.85 90 top
ROFF2  59.69,69.85 90 top
ROFF3  85.09,69.85 90 top
ROFF4  110.49,69.85 90 top
RSNS  5.08,93.98 0 top
RSNS1  30.48,93.98 0 top
RSNS2  55.88,93.98 0 top
RSNS3  81.28,93.98 0 top
RSNS4  106.68,93.98 0 top
RUV1  2.54,69.85 90 top
RUV2  1.91,76.2 90 top
RUV3  27.94,69.85 90 top
RUV4  27.3,76.2 90 top
RUV5  53.34,69.85 90 top
RUV6  52.7,76.2 90 top
RUV7  78.74,69.85 90 top
RUV8  78.11,76.2 90 top
RUV9  104.14,69.85 90 top
RUV10  103.5,76.2 90 top
U1  75.56,24.77 90 top
U2  83.19,24.77 90 top
U$1  5.08,76.2 0 top
U$2  30.48,76.2 0 top
U$3  55.88,76.2 0 top
U$4  81.28,76.2 0 top
U$5  106.68,76.2 0 top
U$6  0,0 0 top
U$7  60.33,45.09 90 top
U$8  33.02,45.09 90 top
U$9  90.17,40.64 180 top
U$10  46.23,15.37 45 bottom
U$11  114.3,48.26 180 top
U$12  114.3,27.94 180 top

### Tracks (layer width: path | path; a pad name or v marks a point on that pad's centre or on a via)
23989SDFJA
  Bottom 0.406: C2.1 40.51,26.04 42.42,24.13 OK1.4 45.34,24.13 | C3.1 43.81,31.11 45.34,29.59 45.34,26.67 | 44.45,21.59 OK1.2 40.22,21.59 C1.2 | 44.45,21.59 45.34,21.59 45.34,24.13 | 45.34,24.13 45.34,26.67 | OK1.6 45.34,26.67 | 44.45,21.59 44.45,17.14 U$10.A
+3V3  (via drill 0.6)
  Top 0.406: 112.39,51.12 U$11.4 | R10.1 122.47,55.37 122.05,55.37 120.44,53.76 C11.1 120.02,51.12 | R12.1 122.47,35.05 122.05,35.05 120.44,33.44 C15.1 120.02,30.8 | C4.1 74.08,30.27 75.78,31.96 R8.2 77.25,31.96 78.95,30.27 C5.1 | U2.8 C5.1 | C5.1 81.7,30.27 83.4,31.96 R7.2
  Top 0.61: ACS711.8 120.02,51.12 v118.75,51.12 | 112.39,51.12 v111.12,51.12 110.81,50.8 C10.1 | ACS1.8 120.02,30.8 v118.75,30.8 118.75,32.38 117.47,33.66 112.39,33.66 111.12,32.38 v111.12,30.8 | C4.1 U1.8 68.2,33.02 v58.42,33.02 | U$8.10 33.15,51.44 36.96,55.24 48.26,55.24 52.07,51.44 U$7.10 | v111.12,30.8 112.14,30.8 U$12.4 | C14.1 110.81,30.48 v111.12,30.8 | v82.55,35.56 83.82,35.56 | 83.82,35.56 v111.12,35.56 | R7.2 83.82,35.56
  Bottom 0.406: 118.62,51.12 v118.75,51.12
  Bottom 0.61: R4.2 R5.2 R6.2 58.42,28.23 v58.42,33.02 58.42,48.26 55.24,51.44 U$7.10 | 118.62,51.12 v111.12,51.12 v111.12,35.56 v111.12,30.8 | 82.55,9.53 v82.55,35.56
  Bottom 0.813: U$6.S47 82.55,9.53
+5V
  Top 0.61: U1.1 U1.2 74.93,23.5 81.28,23.5 U2.1 U2.2 82.55,20.32 83.19,19.68 85.09,19.68 | U$6.S48 85.14,19.64 85.09,19.68 | C18.+ 87.97,21.59 86.06,19.68 85.09,19.68
+5V_SERVO1  (via drill 0.6)
  Top 0.61: U1.4 U1.3 76.2,20.95 74.93,19.68 73.15,19.68 v69.98,22.86 | 57.15,15.24 v57.18,15.21 U$6.S22
  Bottom 0.61: v57.18,15.21 64.83,22.86 v69.98,22.86
+5V_SERVO2  (via drill 0.6)
  Top 0.61: U2.4 U2.3 83.82,22.86 81.92,24.77 v69.22,24.77 | U$6.S21 54.64,15.21 v54.61,15.24
  Bottom 0.61: v69.22,24.77 64.14,24.77 v54.61,15.24
+12V  (via drill 0.6)
  Top 0.61: U$7.16 64.14,36.2 66.04,34.29 67.94,34.29 71.63,37.97 C16.+ 71.97,38.1 90.17,38.1 | U$8.16 26.54,36.07 21.26,36.07 20.32,37.01 C17.+ | C12.1 109.73,25.4 112.33,25.4 U$12.5 | C9.+ 110.64,41.76 110.07,42.33 | v109.73,40.13 106.48,36.88 90.17,36.88 90.17,38.1 | U$9.MB 90.17,38.1 | U$11.5 112.33,45.72 C8.1
  Top 0.813: v109.73,19.18 109.73,20.79 C13.+ 109.73,22.65 109.73,25.4 v109.73,26.8 | C8.1 109.73,45.43 v109.73,40.13 109.73,40.85 C9.+
  Bottom 0.61: U$7.16 53.98,35.56 51.44,33.02 29.46,33.02 26.67,35.81 U$8.16 | U$6.P10.10 109.69,13.03 109.69,19.14
  Bottom 0.813: 109.69,19.14 v109.73,19.18 | v109.73,40.13 v109.73,26.8
  pour Top (no thermals): 106.05,13.97 110.49,13.97 110.49,1.91 106.05,1.91
+48V_FILT
  Top 0.305: CF.1 4.23,82.07 4.04,82.07 4.04,78.6 U$1.10 4.09,77.55 | 4.09,77.55 5.08,77.55 | 5.08,77.55 U$1.8 | RUV2.2 2.15,77.05 2.62,77.52 4.06,77.52 4.09,77.55 | 29.44,78.84 29.44,78.6 U$2.10 | 29.44,78.84 29.44,78.89 | 29.44,78.89 29.44,82.07 | 29.44,82.07 29.63,82.07 CF1.1 | U$2.10 29.49,77.55 | U$2.8 30.48,77.55 29.49,77.55 | 27.96,77.47 27.55,77.05 RUV4.2 27.52,77.05 27.94,77.47 27.96,77.47 | 54.84,78.89 54.84,78.6 U$3.10 54.89,77.7 | 54.84,78.89 54.84,78.97 | 54.84,78.97 54.84,82.07 | 54.84,82.07 55.03,82.07 CF2.1 | 54.89,77.7 54.89,77.55 | 54.89,77.55 54.91,77.55 | 55.88,77.55 U$3.8 | 54.81,77.52 54.86,77.52 54.89,77.55 | 80.24,78.79 80.24,78.6 U$4.10 | 80.24,79.02 80.24,82.07 | 80.24,82.07 80.43,82.07 CF3.1 | U$4.10 80.29,77.57 | 80.29,77.57 80.29,77.55 | U$4.8 81.28,77.55 80.29,77.55 | 80.24,77.52 80.26,77.52 80.29,77.55 | 105.64,78.64 105.64,78.6 U$5.10 105.69,78.59 | 105.64,78.64 105.64,79.07 | 105.64,79.07 105.64,82.07 | 105.64,82.07 105.83,82.07 CF4.1 | 105.69,77.62 105.69,77.55 | 105.69,77.55 106.68,77.55 U$5.8 | 105.61,77.52 105.66,77.52 105.69,77.55 | 5.08,77.55 5.08,77.52 4.04,77.52 4.04,82.47 3.81,82.47 3.81,90.17 2.54,91.44 2.54,93.98 | 29.49,78.84 29.44,78.84 | 29.44,82.83 29.44,82.86 29.21,82.86 29.21,90.17 | 55.85,77.57 55.88,77.55 | 55.88,77.55 54.91,77.55 | 54.91,77.55 54.89,77.7 | 54.89,77.7 54.86,77.72 54.86,78.87 54.84,78.89 | 54.84,82.32 54.84,82.73 54.61,82.96 | U$4.10 80.29,78.79 | 80.29,78.79 80.24,78.79 | 80.24,78.79 80.24,79.02 | 80.24,82.32 80.24,82.63 80.01,82.63 | 105.61,77.52 104.22,77.52 103.75,77.05 RUV10.2 103.72,77.05 104.14,77.47 104.14,77.5 104.19,77.55 105.66,77.55 105.69,77.52 105.69,79.02 105.64,79.07
  Top 0.305: 105.61,77.52 105.66,77.57 105.66,77.6 105.69,77.62 | 105.69,77.62 105.69,78.59 | 105.69,78.59 105.64,78.64 | 105.64,82.32 105.64,89.94 105.41,90.17 | 27.96,77.47 28.02,77.52 29.46,77.52 29.49,77.55 | U$2.10 29.49,78.84 | 29.49,78.84 29.44,78.89 | 29.44,82.07 29.44,82.83 | 29.44,82.83 29.11,83.16 29.11,90.07 29.21,90.17 | 29.21,90.17 27.94,91.44 27.94,93.98 27.69,94.23 | RUV6.2 52.95,77.05 53.42,77.52 54.81,77.52 | 54.81,77.52 54.86,77.57 54.86,78.94 54.84,78.97 | 54.84,82.07 54.84,82.32 | 54.84,82.32 54.61,82.55 54.61,82.96 | 54.61,82.96 54.61,90.17 53.34,91.44 53.34,94.08 53.11,94.31 53.11,94.18 53.06,94.13 | RUV8.2 78.34,77.05 78.82,77.52 80.24,77.52 | 80.24,77.52 80.29,77.57 | 80.29,78.79 80.29,78.97 80.24,79.02 | 80.24,82.07 80.24,82.32 | 80.24,82.32 80.01,82.55 80.01,82.63 | 80.01,82.63 80.01,90.17 78.74,91.44 78.74,94.08 78.49,94.34 | 105.64,82.07 105.64,82.32 | 105.64,82.32 105.41,82.55 105.41,90.17 | 105.41,90.17 104.14,91.44 104.14,93.98 103.99,93.98 103.91,93.9
  Top 1.016: 2.54,93.72 2.54,91.44 3.68,90.3 CIN2.1 CIN1.1 3.68,83.1 CF.1 | 2.54,93.72 RSNS.1 | RSNS1.1 27.94,93.72 27.94,91.44 29.08,90.3 CIN4.1 CIN3.1 29.08,83.1 CF1.1 | RSNS2.1 53.34,93.72 53.34,91.44 54.48,90.3 CIN6.1 CIN5.1 54.48,83.1 CF2.1 | RSNS3.1 78.74,93.72 78.74,91.44 79.88,90.3 CIN8.1 CIN7.1 79.88,83.1 CF3.1 | RSNS4.1 104.14,93.72 104.14,91.44 105.28,90.3 CIN10.1 CIN9.1 105.28,83.1 CF4.1 | 2.54,93.72 2.54,94.59 2.23,94.89
  Top 1.676: 120.65,12.7 127.64,19.68
  Top 1.778: RSNS2.1 53.01,93.98 | 2.23,94.89 2.23,97.79 | 27.69,94.23 27.69,97.54 | 53.06,94.13 53.06,97.51 | 78.49,94.34 78.49,97.54 | 103.91,93.9 103.91,97.56
  pour Top (isolate 1.016, no thermals): 117.47,1.27 130.18,1.27 130.18,100.33 0,100.33 0,96.52 127.64,96.52 127.64,23.5 117.47,13.97
BILGE  (via drill 0.6)
  Top 0.61: U$9.1 U$9.2 | U$9.2 U$9.3 | v90.81,45.09 U$9.2
  Bottom 0.406: U$6.S32 83.82,5.72 83.82,12.7
  Bottom 0.61: 83.82,12.7 83.82,40.01 88.9,45.09 v90.81,45.09
BILGEPWM  (via drill 0.6)
  Top 0.406: v73.66,40.01 83.82,40.01 85.94,42.12 R15.2
  Top 0.61: R15.2 86.05,43.29 U$9.4
  Bottom 0.406: U$6.S41 68.58,10.7 68.58,18.41 71.12,20.95 71.12,27.3 73.66,29.84 v73.66,40.01
CLAW+  (via drill 0.6)
  Top 0.813: U$11.6 v113.67,43.81 | v118.11,53.98 115.57,56.52 26.67,56.52 15.24,45.09 15.24,35.56 36.32,14.48 U$6.P6.1
  Bottom 0.813: v113.67,43.81 114.3,43.81 120.65,50.16 120.65,51.44 v118.11,53.98
  pour Top (no thermals): 36.2,13.34 40.01,13.34 40.01,1.91 35.56,1.91 35.56,13.34
CLAW-
  Top 0.61: ACS711.4 ACS711.3 122.56,44.45 111.76,34.29 99.06,34.29 93.32,28.55 U$6.P7.10
  pour Top (no thermals): 89.92,13.97 93.98,13.97 93.98,1.91 89.92,1.91
CLAWCURRENT  (via drill 0.6)
  Top 0.406: v92.71,45.09 102.87,55.24 114.3,55.24 117.47,52.07 117.47,50.8 119.38,48.9 120.65,48.9 121.28,49.53 ACS711.7
  Bottom 0.406: U$6.S40 85.14,7.04 86.36,8.26 86.36,38.73 v92.71,45.09
CLAWPWM1  (via drill 0.6)
  Top 0.406: v96.52,45.09 104.14,52.7 113.03,52.7 113.67,52.07 U$11.3
  Bottom 0.406: U$6.S25 67.36,3.12 69.22,1.27 86.36,1.27 88.9,3.81 88.9,37.47 v96.52,45.09
CLAWPWM2  (via drill 0.6)
  Top 0.406: U$11.2 114.94,52.7 113.67,53.98 103.5,53.98 v94.61,45.09
  Bottom 0.406: U$6.S26 70.53,3.76 71.75,2.54 85.72,2.54 87.63,4.45 87.63,38.1 v94.61,45.09
EXTGND
  Bottom 0.406: 52.1,9.49 U$6.S20 47.01,14.57 U$10.C
GND  (via drill 0.51, 0.6)
  Top 0.254: U$1.5 7.61,73.8 v8.26,73.15 | U$2.5 33.01,73.8 v33.66,73.15 | U$3.5 58.41,73.8 v59.05,73.15 | U$4.5 83.81,73.8 v84.45,73.15 | U$5.5 109.21,73.8 v109.86,73.15
  Top 0.406: R13.1 61.76,39.28 v61.21,38.73 | R14.1 36.58,48.51 v35.56,49.53 | U1.5 79.64,27.57 v80.01,27.94 | R15.1 84.24,44.03 v83.82,44.45
  Top 0.61: U$7.15 v61.21,38.73 | R11.1 115.99,20.32 v116.84,20.32 | U$12.1 119.57,27.18 123.06,27.18 v123.83,27.94 ACS1.5 124.46,31.18 124.46,35.56 123.19,36.83 121.92,36.83 120.23,35.14 C15.2 | C11.2 120.23,55.46 121.92,57.15 123.19,57.15 124.46,55.88 124.46,51.49 ACS711.5 v123.83,48.26 123.19,47.62 119.13,47.62 116.2,50.55 U$11.1 | C6.2 v67.31,26.67 | R9.1 115.57,40.64 v114.3,39.37 | C17.- 22.86,40.3 22.86,39.37 23.5,38.73 U$8.15 | C16.- 72.39,43.6 v72.39,46.99
  Bottom 0.406: v80.01,27.94 80.01,29.21 | v83.82,44.45 85.09,44.45
  Bottom 0.61: v116.84,20.32 116.84,21.59 | v123.83,27.94 125.73,27.94 | v67.31,26.67 66.04,27.94 | v114.3,39.37 115.57,39.37 | v123.83,48.26 124.46,48.26
  other vias: 51.18,21.34 48.39,24 46.48,25.91 80.01,35.56 12.7,76.2 22.86,76.2 38.1,76.2 48.26,76.2 63.5,76.2 73.66,76.2 88.9,76.2 99.06,76.2 114.3,76.2 124.46,76.2 12.7,63.5 2.54,63.5 56.77,32.51 61.59,27.81 68.45,21.08 71.12,33.02 104.14,49.53 104.14,45.72 104.14,39.37 93.98,33.02 104.14,30.48 104.14,25.4 104.14,19.05 54.36,18.03 6.35,87 31.75,87 57.15,87 82.55,87 107.95,87 72.39,49.53 80.01,49.53 80.01,46.99 83.82,49.53 83.82,46.99 65.66,1.27 88.14,1.27
  pour Bottom (isolate 0.305, rank 2): 0,100.33 130.18,100.33 130.18,0 0,0
  pour Top (isolate 0.305): 0,59.69 11.43,59.69 17.78,66.04 125.73,66.04 125.73,95.25 0,95.25
  pour Top: 69.6,31.5 82.04,31.5 82.04,34.04 81.15,34.92 81.15,36.96 72.64,36.96 68.45,32.77 69.6,31.62
  pour Top: 101.6,16.51 108.46,16.51 108.58,16.38 108.58,34.16 101.73,34.16 101.6,34.29 101.6,17.78
  pour Top: 43.18,29.21 43.18,27.94 43.18,27.18 53.34,17.02 55.88,17.02 55.88,18.16 55.75,18.29 55.75,18.54 45.09,29.21
  pour Top: 54.61,33.02 68.58,19.05 72.39,19.05 57.15,34.29 55.88,34.29
  pour Top: 101.6,36.83 108.46,36.83 108.58,36.7 108.58,54.48 101.73,54.48 101.6,54.61 101.6,38.1
  pour Top: 83.82,26.67 91.44,26.67 96.52,31.75 96.52,35.56 85.09,35.56 83.82,34.29 83.82,27.94
  pour Top (no thermals): 17.78,95.25 17.78,91.44 25.4,91.44 25.4,95.25
  pour Top (no thermals): 43.18,95.25 43.18,91.44 50.8,91.44 50.8,95.25
  pour Top (no thermals): 68.58,95.25 68.58,91.44 76.2,91.44 76.2,95.25
  pour Top (no thermals): 93.98,95.25 93.98,91.44 101.6,91.44 101.6,95.25
  pour Top (no thermals): 120.65,95.25 120.65,91.44 125.73,91.44 125.73,95.25
  pour Top: 71.12,45.72 85.09,45.72 85.09,50.8 71.12,50.8
  pour Top: 64.77,2.54 88.9,2.54 88.9,0 64.77,0
LEDPWM1  (via drill 0.6)
  Top 0.305: U$1.3 v5.08,72.39
  Bottom 0.406: U$6.S27 71.12,5.72 71.12,10.16 69.85,11.43 69.85,18.41 72.39,20.95 72.39,27.3 74.93,29.84 74.93,64.77 70.48,69.22 8.26,69.22 v5.08,72.39
LEDPWM2  (via drill 0.6)
  Top 0.305: U$2.3 v30.48,72.39
  Bottom 0.406: U$6.S28 73.66,5.72 73.66,10.16 72.39,11.43 72.39,18.41 74.93,20.95 74.93,27.3 76.2,28.57 76.2,66.67 72.39,70.48 32.38,70.48 v30.48,72.39
LEDPWM3  (via drill 0.6)
  Top 0.305: U$3.3 v55.88,72.39
  Bottom 0.406: U$6.S29 76.2,5.72 76.2,10.16 74.93,11.43 74.93,18.41 77.47,20.95 77.47,68.58 74.3,71.75 56.52,71.75 v55.88,72.39
LEDPWM4  (via drill 0.6)
  Top 0.305: U$4.3 v81.28,71.12
  Bottom 0.406: U$6.S30 78.74,5.72 78.74,68.58 v81.28,71.12
LEDPWM5  (via drill 0.6)
  Top 0.305: U$5.3 v106.68,72.39
  Bottom 0.406: U$6.S31 81.28,5.72 81.28,67.94 83.82,70.48 104.78,70.48 v106.68,72.39
LEDPWR1
  Top 0.406: ROFF.1 17.4,69 L1.P$2
  Top 1.016: 17.78,67.31 17.78,68.58 L1.P$2
  Top 1.676: 17.78,66.04 2.54,50.8 2.54,19.18 U$6.P1.1
  Top 1.778: 17.78,66.04 17.78,68.58
  pour Top (no thermals): 8.26,13.97 12.7,13.97 12.7,1.91 8.26,1.91
LEDPWR2
  Top 0.406: ROFF1.1 42.8,69 L2.P$2
  Top 1.016: 43.18,67.31 43.18,68.58 L2.P$2
  Top 1.676: 31.75,66.04 21.59,66.04 5.08,49.53 5.08,24.13 14.32,14.89 U$6.P2.1
  Top 1.778: 31.75,66.04 43.18,66.04 43.18,68.58
  pour Top (no thermals): 13.97,13.97 17.78,13.97 17.78,1.91 13.97,1.91
LEDPWR3
  Top 0.406: ROFF2.1 68.2,69 L3.P$2
  Top 1.016: 68.58,67.31 68.58,68.58 L3.P$2
  Top 1.676: 34.29,63.5 22.86,63.5 7.62,48.26 7.62,27.94 20.32,15.24 20.32,13.4 U$6.P3.1
  Top 1.778: 34.29,63.5 68.58,63.5 68.58,68.58
  pour Top (no thermals): 19.05,13.97 23.5,13.97 23.5,1.91 19.05,1.91
LEDPWR4
  Top 1.016: ROFF3.1 85.09,67.31 93.98,67.31 L4.P$2
  Top 1.676: 36.83,60.96 24.13,60.96 10.16,46.99 10.16,30.48 25.4,15.24 25.32,15.16 U$6.P4.1
  Top 1.778: L4.P$2 93.98,60.96 36.83,60.96
  pour Top (no thermals): 24.77,13.97 29.21,13.97 29.21,1.91 24.77,1.91
LEDPWR5
  Top 0.406: ROFF4.1 118.96,69 119.38,68.58
  Top 1.016: 119.38,67.31 119.38,68.58
  Top 1.676: 39.37,58.42 25.4,58.42 12.7,45.72 12.7,33.02 30.82,14.9 U$6.P5.1
  Top 1.778: L5.P$2 119.38,68.58 119.38,58.42 39.37,58.42
  pour Top (no thermals): 30.48,13.97 34.29,13.97 34.29,1.91 30.48,1.91
LKJOI
  Top 0.61: U$12.8 ACS1.1 ACS1.2
N$1
  Top 0.254: U$2.1 29.48,72.9 28.96,72.9 | 28.96,72.9 RUV3.2 | RUV4.1 27.3,74.55 28.96,72.9
N$2
  Top 0.254: U$1.1 4.08,72.9 3.56,72.9 | 3.56,72.9 RUV1.2 | RUV2.1 1.91,74.55 3.56,72.9
N$3
  Top 0.305: U$1.9 4.58,80.17 5.84,81.43 5.84,82.46 CF.2
N$4
  Top 0.305: RSNS.2 7.88,82.35 5.59,80.06 U$1.7
  Top 1.016: Q1.2 8.87,94.97 RSNS.2
N$5
  Top 0.254: U$1.4 5.58,73.16 6.35,72.39 COFF.1
  Top 0.406: COFF.1 ROFF.2
N$6
  Top 0.305: Q1.1 12.42,94.97 8.89,91.44 8.89,82.47 6.1,79.68 6.1,78.62 U$1.6
N$7
  Top 1.778: D1.C 17.78,86.47 | 17.78,86.47 13.9,86.47 Q1.3 | L1.P$1 17.78,86.47
N$8
  Top 0.305: U$2.9 29.98,80.17 31.24,81.43 31.24,82.46 CF1.2
N$9
  Top 0.305: RSNS1.2 33.28,82.35 30.99,80.06 U$2.7
  Top 1.016: Q2.2 34.27,94.97 RSNS1.2
N$10
  Top 0.254: U$2.4 30.98,73.16 31.75,72.39 COFF1.1
  Top 0.406: COFF1.1 ROFF1.2
N$11
  Top 0.305: Q2.1 37.82,94.97 34.29,91.44 34.29,82.47 31.5,79.68 31.5,78.62 U$2.6
N$12
  Top 1.778: D2.C 43.18,86.47 | 43.18,86.47 39.3,86.47 Q2.3 | L2.P$1 43.18,86.47
N$13
  Top 0.254: U$3.1 54.88,72.9 54.36,72.9 | 54.36,72.9 RUV5.2 | RUV6.1 52.7,74.55 54.36,72.9
N$14
  Top 0.305: U$3.9 55.38,80.17 56.64,81.43 56.64,82.46 CF2.2
N$15
  Top 0.305: RSNS2.2 58.68,82.35 56.39,80.06 U$3.7
  Top 1.016: Q3.2 59.67,94.97 RSNS2.2
N$16
  Top 0.254: U$3.4 56.38,73.16 57.15,72.39 COFF2.1
  Top 0.406: COFF2.1 ROFF2.2
N$17
  Top 0.305: Q3.1 63.22,94.97 59.69,91.44 59.69,82.47 56.9,79.68 56.9,78.62 U$3.6
N$18
  Top 1.778: D3.C 68.58,86.47 | 68.58,86.47 64.7,86.47 Q3.3 | L3.P$1 68.58,86.47
N$19
  Top 0.254: U$4.1 80.28,72.9 79.76,72.9 | 79.76,72.9 RUV7.2 | RUV8.1 78.11,74.55 79.76,72.9
N$20
  Top 0.305: U$4.9 80.78,80.17 82.04,81.43 82.04,82.46 CF3.2
N$21
  Top 0.305: RSNS3.2 84.08,82.35 81.79,80.06 U$4.7
  Top 1.016: Q4.2 85.07,94.97 RSNS3.2
N$22
  Top 0.254: U$4.4 81.78,73.16 82.55,72.39 COFF3.1
  Top 0.406: COFF3.1 ROFF3.2
N$23
  Top 0.305: Q4.1 88.62,94.97 85.09,91.44 85.09,82.47 82.3,79.68 82.3,78.62 U$4.6
N$24
  Top 1.778: D4.C 93.98,86.47 | 93.98,86.47 90.1,86.47 Q4.3 | L4.P$1 93.98,86.47
N$25
  Top 0.254: U$5.1 105.68,72.9 105.16,72.9 | 105.16,72.9 RUV9.2 | RUV10.1 103.5,74.55 105.16,72.9
N$26
  Top 0.305: U$5.9 106.18,80.17 107.44,81.43 107.44,82.46 CF4.2
N$27
  Top 0.305: U$5.7 107.19,80.06 109.48,82.35 RSNS4.2
  Top 1.016: Q5.2 110.47,94.97 RSNS4.2
N$28
  Top 0.254: U$5.4 107.18,73.16 107.95,72.39 COFF4.1
  Top 0.406: COFF4.1 ROFF4.2
N$29
  Top 0.305: Q5.1 114.02,94.97 110.49,91.44 110.49,82.47 107.7,79.68 107.7,78.62 U$5.6
N$30
  Top 1.778: D5.C 119.38,86.47 | 119.38,86.47 115.5,86.47 Q5.3 | L5.P$1 119.38,86.47
N$31
  Bottom 0.406: OK1.1 43.37,18.98 42.8,18.41 R1.2
N$32
  Bottom 0.406: OK1.3 40.22,22.86 R2.2
N$33
  Bottom 0.406: OK1.5 42.76,25.4 R3.2
N$34
  Top 0.406: U$11.7 114.94,43.4 R9.2
N$35
  Top 0.406: R10.2 ACS711.6
N$36  (via drill 0.33 pad 0.25)
  other vias: 113.28,48.9
N$37  (via drill 0.33 pad 0.25)
  other vias: 114.3,48.26
N$38  (via drill 0.33 pad 0.25)
  other vias: 115.44,47.62
N$39  (via drill 0.33 pad 0.25)
  other vias: 113.28,47.62
N$40  (via drill 0.33 pad 0.13)
  other vias: 115.44,48.9
N$41
  Top 0.406: U$12.7 114.94,23.07 R11.2
N$42
  Top 0.406: R12.2 ACS1.6
N$43  (via drill 0.33 pad 0.25)
  other vias: 113.28,28.57
N$44  (via drill 0.33 pad 0.25)
  other vias: 114.3,27.94
N$45  (via drill 0.33 pad 0.25)
  other vias: 115.44,27.3
N$51  (via drill 0.33 pad 0.25)
  other vias: 113.28,27.3
N$52  (via drill 0.33 pad 0.13)
  other vias: 115.44,28.57
N$53
  Top 0.406: U$7.2 U$7.3 U$7.4 65.44,43.81 R13.2
N$54
  Top 0.406: U$7.5 U$7.6
N$55
  Top 0.406: U$8.2 U$8.3 U$8.4 38.14,43.81 R14.2
N$56
  Top 0.406: U$8.5 U$8.6
N$57
  Top 0.406: U2.6 R7.1
N$58
  Top 0.406: U1.6 R8.1
SERVO1CURRENT  (via drill 0.6)
  Top 0.406: U$6.S36 73.66,8.26 v73.66,14.61 | 82.55,26.04 U2.7 | v76.2,26.04 82.55,26.04 | 82.55,26.04 87,26.04 C7.1
  Bottom 0.406: v73.66,14.61 73.66,18.41 76.2,20.95 v76.2,26.04
SERVO2CURRENT  (via drill 0.6)
  Top 0.406: U$6.S35 71.12,8.26 v71.12,14.61 | C6.1 72,26.04 v73.66,26.04 74.93,26.04 U1.7
  Bottom 0.406: v71.12,14.61 71.12,18.41 73.66,20.95 v73.66,26.04
STEP1
  Top 0.406: U$6.S33 64.77,9.53 64.77,17.14 48.26,33.66 48.26,37.47 50.8,40.01 58.29,40.01 60.96,42.67 60.96,49.53 62.87,51.44 U$7.7
STEP1A1
  Top 0.406: 53.34,12.7 53.34,8.24 U$6.S13
  Top 0.61: 53.34,12.7 53.34,17.14 43.18,27.3 43.18,38.1 51.44,46.35 U$7.12
STEP1A2
  Top 0.406: 55.88,12.7 55.88,8.24 U$6.S14
  Top 0.61: 55.88,12.7 55.88,18.41 45.09,29.21 45.09,38.1 50.8,43.81 U$7.13
STEP1B1  (via drill 0.6)
  Top 0.406: 58.42,12.7 58.42,8.24 U$6.S15
  Top 0.61: 58.42,12.7 58.42,18.41 v46.35,30.48
  Bottom 0.61: v46.35,30.48 52.7,30.48 57.15,35.56 57.15,47.62 55.88,48.9 U$7.11
STEP1B2
  Top 0.406: 60.96,12.7 60.96,8.24 U$6.S16
  Top 0.61: 60.96,12.7 60.96,18.41 46.99,32.38 46.99,38.1 50.16,41.27 U$7.14
STEP2  (via drill 0.6)
  Top 0.305: U$6.S43 72.39,9.53
  Top 0.406: 72.39,9.53 72.39,15.24 52.07,35.56 v51.82,35.69
  Bottom 0.305: 39.5,51.31 U$8.7
  Bottom 0.406: U$8.7 49.02,51.31 51.82,48.51 v51.82,35.69
STEP2A1
  Top 0.61: U$6.S9 41.91,9.51 41.91,18.41 29.21,31.11 29.21,39.37 28.57,40.01 24.77,40.01 24.13,40.64 24.13,43.81 U$8.12
STEP2A2
  Top 0.406: 45.72,12.7 45.72,8.24 U$6.S10
  Top 0.61: 45.72,12.7 45.72,17.14 31.5,31.37 31.5,41.15 28.83,43.81 U$8.13
STEP2B1
  Top 0.406: 48.26,12.7 48.26,8.24 U$6.S11
  Top 0.61: 48.26,12.7 48.26,17.14 34.29,31.11 34.29,43.43 28.83,48.9 U$8.11
STEP2B2  (via drill 0.51)
  Top 0.406: 50.8,12.7 50.8,8.24 U$6.S12
  Top 0.61: 50.8,12.7 50.8,17.14 36.58,31.37 v36.58,41.15
  Bottom 0.61: v36.58,41.15 26.8,41.15 U$8.14
STEPDIR1  (via drill 0.6)
  Top 0.305: U$6.S44 74.93,9.53
  Top 0.406: 74.93,9.53 74.93,16.51 v59.69,31.75
  Bottom 0.406: v59.69,31.75 59.69,52.07 61.59,53.98 U$7.8
STEPDIR2  (via drill 0.6)
  Top 0.406: v50.8,34.92 69.9,15.82 U$6.S42
  Bottom 0.406: v50.8,34.92 50.8,47.62 48.26,50.16 37.47,50.16 36.83,50.8 36.83,52.07 38.73,53.98 U$8.8
STEPEN  (via drill 0.6)
  Top 0.406: U$7.1 65.41,37.47 50.8,37.47 v49.53,36.2 49.53,34.29 68.58,15.24 68.58,8.26 U$6.S34
  Bottom 0.406: U$8.1 v49.53,36.2
TURN+
  Top 0.61: U$12.6 113.67,18.41 111.76,16.51 101.6,16.51 98.82,13.73 U$6.P8.10
  pour Top (no thermals): 95.25,13.97 99.69,13.97 99.69,1.91 95.25,1.91
TURN-
  Top 0.61: ACS1.4 ACS1.3 122.56,23.5 114.3,15.24 106.05,15.24 104.32,13.52 U$6.P9.10
  pour Top (no thermals): 100.97,13.97 104.78,13.97 104.78,1.91 100.97,1.91
TURNCURRENT  (via drill 0.6)
  Top 0.406: U$6.S37 78.74,5.72 78.74,2.54 86.36,2.54 88.9,5.08 88.9,17.14 v92.08,20.32 | ACS1.7 v121.28,28.57
  Bottom 0.406: v92.08,20.32 113.03,20.32 v121.28,28.57
TURNPWM1  (via drill 0.6)
  Top 0.406: v90.81,22.86 86.36,18.41 86.36,8.26 83.92,8.26 U$6.S39 | v113.67,32.38 U$12.3
  Bottom 0.406: v90.81,22.86 113.03,22.86 117.47,27.3 117.47,27.94 113.67,31.75 v113.67,32.38
TURNPWM2  (via drill 0.6)
  Top 0.406: U$6.S38 81.28,5.71 86.36,5.71 87.63,6.99 87.63,17.78 v91.44,21.59 | v114.94,32.38 U$12.2
  Bottom 0.406: v91.44,21.59 113.03,21.59 118.75,27.3 118.75,28.57 v114.94,32.38
VPROBE1
  Bottom 0.406: C1.1 R1.1 37.88,18 38.73,17.14 41.9,17.14 U$6.S19
VPROBE2
  Bottom 0.406: C2.2 R2.1 37.47,23.5 36.2,22.23 36.2,17.78 38.1,15.88 40.62,15.88 U$6.S18
VPROBE3
  Bottom 0.406: C3.2 R3.1 36.2,28.57 34.29,26.67 34.29,17.14 36.83,14.61 40.01,14.61 44.45,10.16 44.45,9.51 U$6.S17
VSEN1
  Bottom 0.406: R4.1 52.7,20.32 | 52.7,20.32 OK1.16 | U$6.S8 62.26,4.42 60.96,5.71 60.96,10.16 57.15,13.97 53.34,13.97 52.7,14.61 52.7,20.32
VSEN2
  Bottom 0.406: R5.1 OK1.14 49.53,22.86 48.26,21.59 48.26,17.14 52.7,12.7 55.88,12.7 58.42,10.16 58.42,5.71 59.72,4.42 U$6.S7
VSEN3
  Bottom 0.406: R6.1 54.61,25.4 OK1.12 48.26,25.4 46.35,23.5 46.35,17.14 52.07,11.43 54.61,11.43 55.88,10.16 55.88,5.7 U$6.S6
WEFSFE
  Top 0.61: U$11.8 ACS711.1 ACS711.2

### Text on the board
_tsilk: Purdue IEEE ROV | Application Board V1 | 2015-03-13 | Rodolfo Leiva, Luke McBee | Ryan Mcbee, Nick Molo, Evan Widloski | LEDPWR1 | LEDPWR2 | LEDPWR3 | LEDPWR4 | CLAW+ | CLAW- | TURN+ | TURN- | +12V | GND | +48V_FILT | LEDPWR5